# EAGLE design HDMI-Display_v11 (EAGLE 7.5.0)

## Sheet 1 of 2
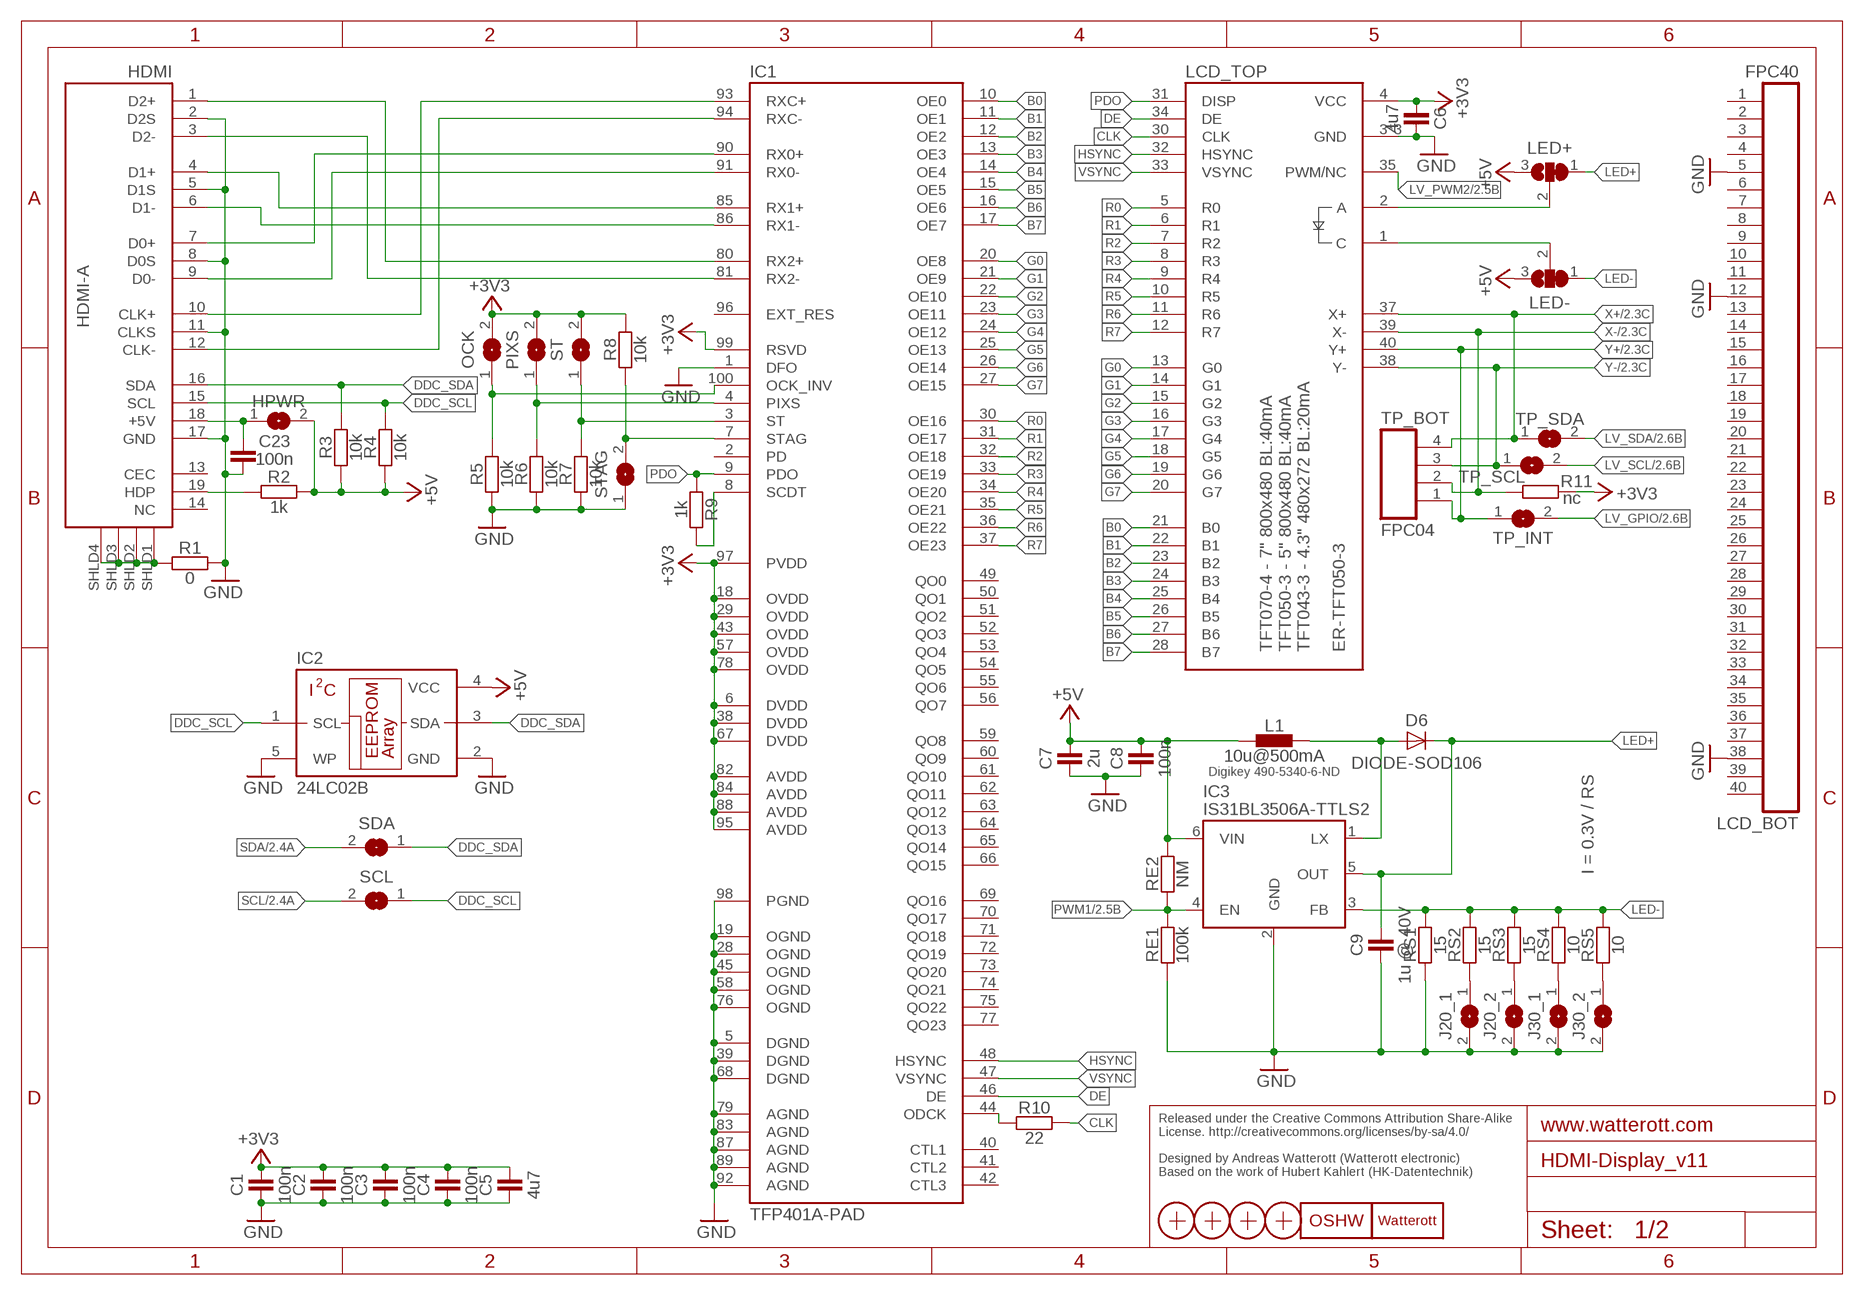
[diagram p0: schematic, sheet 1]

### Parts
C1  100n  CAPACITOR-0402  [C0402]
C2  100n  CAPACITOR-0402  [C0402]
C3  100n  CAPACITOR-0402  [C0402]
C4  100n  CAPACITOR-0402  [C0402]
C5  4u7  CAPACITOR-0402  [C0402]
C6  4u7  CAPACITOR-0402  [C0402]
C7  2u  CAPACITOR-0402  [C0402]
C8  100n  CAPACITOR-0402  [C0402]
C9  1u @ 40V  CAPACITOR-0805  [C0805]
C23  100n  CAPACITOR-0402  [C0402]
D6  DIODE-SOD106  [SOD106]
HDMI  HDMI-A  [HDMI_10029449]
HPWR  JUMPER2-0402  [JUMPER2-0402]
IC1  TFP401A-PAD  [TQFP100-PAD]
IC2  24LC02B  24LC-I/OT  [SOT23-5]
IC3  IS31BL3506A-TTLS2  [SOT23-6]
J20_1  JUMPER2-0402  [JUMPER2-0402]
J20_2  JUMPER2-0402  [JUMPER2-0402]
J30_1  JUMPER2-0402  [JUMPER2-0402]
J30_2  JUMPER2-0402  [JUMPER2-0402]
L1  10u@500mA  INDUCTOR-1212  [L_1212]
LCD_BOT  FPC40  [FPC40]
LCD_TOP  ER-TFT050-3  [FPC40]
LED+  JUMPER3-0402  [JUMPER3-0402]
LED-  JUMPER3-0402  [JUMPER3-0402]
LOGO1  OSHW_LOGOX0070  [OSHW_6X70]
LOGO3  LOGO-S_PLACE_S  [SPARK_TPLACE_S]
OCK  JUMPER2-0201-NC  [JUMPER2-0201_NC]
PIXS  JUMPER2-0201-NC  [JUMPER2-0201_NC]
R1  0  RESISTOR-0402  [C0402]
R2  1k  RESISTOR-0402  [C0402]
R3  10k  RESISTOR-0402  [C0402]
R4  10k  RESISTOR-0402  [C0402]
R5  10k  RESISTOR-0402  [C0402]
R6  10k  RESISTOR-0402  [C0402]
R7  10k  RESISTOR-0402  [C0402]
R8  10k  RESISTOR-0402  [C0402]
R9  1k  RESISTOR-0402  [C0402]
R10  22  RESISTOR-0402  [C0402]
R11  nc  RESISTOR-0402  [C0402]
RE1  100k  RESISTOR-0402  [C0402]
RE2  NM  RESISTOR-0402  [C0402]
RS1  15  RESISTOR-0402  [C0402]
RS2  15  RESISTOR-0402  [C0402]
RS3  15  RESISTOR-0402  [C0402]
RS4  10  RESISTOR-0402  [C0402]
RS5  10  RESISTOR-0402  [C0402]
SCL  JUMPER2-0402  [JUMPER2-0402]
SDA  JUMPER2-0402  [JUMPER2-0402]
ST  JUMPER2-0201-NC  [JUMPER2-0201_NC]
STAG  JUMPER2-0201-NC  [JUMPER2-0201_NC]
TP_BOT  FPC04  [FPC04]
TP_INT  JUMPER2-0402  [JUMPER2-0402]
TP_SCL  JUMPER2-0402  [JUMPER2-0402]
TP_SDA  JUMPER2-0402  [JUMPER2-0402]
X1  PASSER-07  [PASSER_07MM]
X2  PASSER-07  [PASSER_07MM]
X3  PASSER-07  [PASSER_07MM]
X4  PASSER-07  [PASSER_07MM]

### Nets
+3V3: C1.2 C2.2 C3.2 C4.2 C5.2 C6.1 IC1.6(DVDD) IC1.18(OVDD) IC1.29(OVDD) IC1.38(DVDD) IC1.43(OVDD) IC1.57(OVDD) IC1.67(DVDD) IC1.78(OVDD) IC1.82(AVDD) IC1.84(AVDD) IC1.88(AVDD) IC1.95(AVDD) IC1.97(PVDD) IC1.99(RSVD) LCD_TOP.4(VCC) OCK.2 PIXS.2 R8.2 R11.2 ST.2 ; also sheet 2
+5V: C7.2 C8.2 HPWR.2 IC2.4(VCC) IC3.6(VIN) L1.1 LED+.3 LED-.3 R2.2 R3.1 R4.1 RE2.2 ; also sheet 2
B0: IC1.10(OE0) LCD_TOP.21(B0)
B1: IC1.11(OE1) LCD_TOP.22(B1)
B2: IC1.12(OE2) LCD_TOP.23(B2)
B3: IC1.13(OE3) LCD_TOP.24(B3)
B4: IC1.14(OE4) LCD_TOP.25(B4)
B5: IC1.15(OE5) LCD_TOP.26(B5)
B6: IC1.16(OE6) LCD_TOP.27(B6)
B7: IC1.17(OE7) LCD_TOP.28(B7)
CLK: LCD_TOP.30(CLK) R10.2
CLK_N: HDMI.12(CLK-) IC1.94(RXC-)
CLK_P: HDMI.10(CLK+) IC1.93(RXC+)
D0_N: HDMI.9(D0-) IC1.91(RX0-)
D0_P: HDMI.7(D0+) IC1.90(RX0+)
D1_N: HDMI.6(D1-) IC1.86(RX1-)
D1_P: HDMI.4(D1+) IC1.85(RX1+)
D2_N: HDMI.3(D2-) IC1.81(RX2-)
D2_P: HDMI.1(D2+) IC1.80(RX2+)
DDC_SCL: HDMI.15(SCL) IC2.1(SCL) R4.2 SCL.1
DDC_SDA: HDMI.16(SDA) IC2.3(SDA) R3.2 SDA.1
DE: IC1.46(DE) LCD_TOP.34(DE)
G0: IC1.20(OE8) LCD_TOP.13(G0)
G1: IC1.21(OE9) LCD_TOP.14(G1)
G2: IC1.22(OE10) LCD_TOP.15(G2)
G3: IC1.23(OE11) LCD_TOP.16(G3)
G4: IC1.24(OE12) LCD_TOP.17(G4)
G5: IC1.25(OE13) LCD_TOP.18(G5)
G6: IC1.26(OE14) LCD_TOP.19(G6)
G7: IC1.27(OE15) LCD_TOP.20(G7)
GND: C1.1 C2.1 C3.1 C4.1 C5.1 C6.2 C7.1 C8.1 C9.1 C23.1 HDMI.2(D2S) HDMI.5(D1S) HDMI.8(D0S) HDMI.11(CLKS) HDMI.17(GND) IC1.1(DFO) IC1.5(DGND) IC1.19(OGND) IC1.28(OGND) IC1.39(DGND) IC1.45(OGND) IC1.58(OGND) IC1.68(DGND) IC1.76(OGND) IC1.79(AGND) IC1.83(AGND) IC1.87(AGND) IC1.89(AGND) IC1.92(AGND) IC1.98(PGND) IC2.2(GND) IC2.5(WP) IC3.2(GND) J20_1.2 J20_2.2 J30_1.2 J30_2.2 LCD_BOT.5 LCD_BOT.12 LCD_BOT.38 LCD_TOP.3(GND) LCD_TOP.29(GND) LCD_TOP.36(GND) R1.1 R5.1 R6.1 R7.1 RE1.1 RS1.1 STAG.1 ; also sheet 2
HDMI_5V: C23.2 HDMI.18(+5V) HPWR.1
HDMI_DECT: HDMI.19(HDP) R2.1
HSYNC: IC1.48(HSYNC) LCD_TOP.32(HSYNC)
LED+: C9.2 D6.C IC3.5(OUT) LED+.1
LED-: IC3.3(FB) LED-.1 RS1.2 RS2.2 RS3.2 RS4.2 RS5.2
LEDA: LCD_TOP.2(A) LED+.2
LEDC: LCD_TOP.1(C) LED-.2
LV_GPIO: TP_INT.2 ; also sheet 2
LV_PWM2: LCD_TOP.35(PWM/NC) ; also sheet 2
LV_SCL: TP_SCL.2 ; also sheet 2
LV_SDA: TP_SDA.2 ; also sheet 2
LX: D6.A IC3.1(LX) L1.2
N$1: J20_2.1 RS3.1
N$3: IC1.44(ODCK) R10.1
N$4: J30_1.1 RS4.1
N$5: J20_1.1 RS2.1
N$7: J30_2.1 RS5.1
OCKINV: IC1.100(OCK_INV) OCK.1 R5.2
PDO: IC1.9(PDO) LCD_TOP.31(DISP) R9.1
PIXS: IC1.4(PIXS) PIXS.1 R6.2
PWM1: IC3.4(EN) RE1.2 RE2.1 ; also sheet 2
R0: IC1.30(OE16) LCD_TOP.5(R0)
R1: IC1.31(OE17) LCD_TOP.6(R1)
R2: IC1.32(OE18) LCD_TOP.7(R2)
R3: IC1.33(OE19) LCD_TOP.8(R3)
R4: IC1.34(OE20) LCD_TOP.9(R4)
R5: IC1.35(OE21) LCD_TOP.10(R5)
R6: IC1.36(OE22) LCD_TOP.11(R6)
R7: IC1.37(OE23) LCD_TOP.12(R7)
SCDT: IC1.8(SCDT) R9.2
SCL: SCL.2 ; also sheet 2
SDA: SDA.2 ; also sheet 2
SHLD3: HDMI.SHLD1(SHLD) HDMI.SHLD2(SHLD) HDMI.SHLD3(SHLD) HDMI.SHLD4(SHLD) R1.2
ST: IC1.3(ST) R7.2 ST.1
STAG: IC1.7(STAG) R8.1 STAG.2
VSYNC: IC1.47(VSYNC) LCD_TOP.33(VSYNC)
X+: LCD_TOP.37(X+) TP_BOT.4 TP_SDA.1 ; also sheet 2
X-: LCD_TOP.39(X-) R11.1 TP_BOT.2 ; also sheet 2
Y+: LCD_TOP.40(Y+) TP_BOT.1 TP_INT.1 ; also sheet 2
Y-: LCD_TOP.38(Y-) TP_BOT.3 TP_SCL.1 ; also sheet 2
Unconnected: HDMI.13(CEC) HDMI.14(NC) IC1.2(PD) IC1.40(CTL1) IC1.41(CTL2) IC1.42(CTL3) IC1.49(QO0) IC1.50(QO1) IC1.51(QO2) IC1.52(QO3) IC1.53(QO4) IC1.54(QO5) IC1.55(QO6) IC1.56(QO7) IC1.59(QO8) IC1.60(QO9) IC1.61(QO10) IC1.62(QO11) IC1.63(QO12) IC1.64(QO13) IC1.65(QO14) IC1.66(QO15) IC1.69(QO16) IC1.70(QO17) IC1.71(QO18) IC1.72(QO19) IC1.73(QO20) IC1.74(QO21) IC1.75(QO22) IC1.77(QO23) IC1.96(EXT_RES) LCD_BOT.1 LCD_BOT.2 LCD_BOT.3 LCD_BOT.4 LCD_BOT.6 LCD_BOT.7 LCD_BOT.8 LCD_BOT.9 LCD_BOT.10 LCD_BOT.11 LCD_BOT.13 LCD_BOT.14 LCD_BOT.15 LCD_BOT.16 LCD_BOT.17 LCD_BOT.18 LCD_BOT.19 LCD_BOT.20 LCD_BOT.21 LCD_BOT.22 LCD_BOT.23 LCD_BOT.24 LCD_BOT.25 LCD_BOT.26 LCD_BOT.27 LCD_BOT.28 LCD_BOT.29 LCD_BOT.30 LCD_BOT.31 LCD_BOT.32 LCD_BOT.33 LCD_BOT.34 LCD_BOT.35 LCD_BOT.36 LCD_BOT.37 LCD_BOT.39 LCD_BOT.40

### Notes on the sheet
- TFT070-4 - 7" 800x480 BL:40mA
  TFT050-3 - 5" 800x480 BL:40mA
  TFT043-3 - 4.3" 480x272 BL:20mA
- Digikey 490-5340-6-ND
- I = 0.3V / RS
- Released under the Creative Commons Attribution Share-Alike 
  License. http://creativecommons.org/licenses/by-sa/4.0/
  
  Designed by Andreas Watterott (Watterott electronic)
  Based on the work of Hubert Kahlert (HK-Datentechnik)

## Sheet 2 of 2
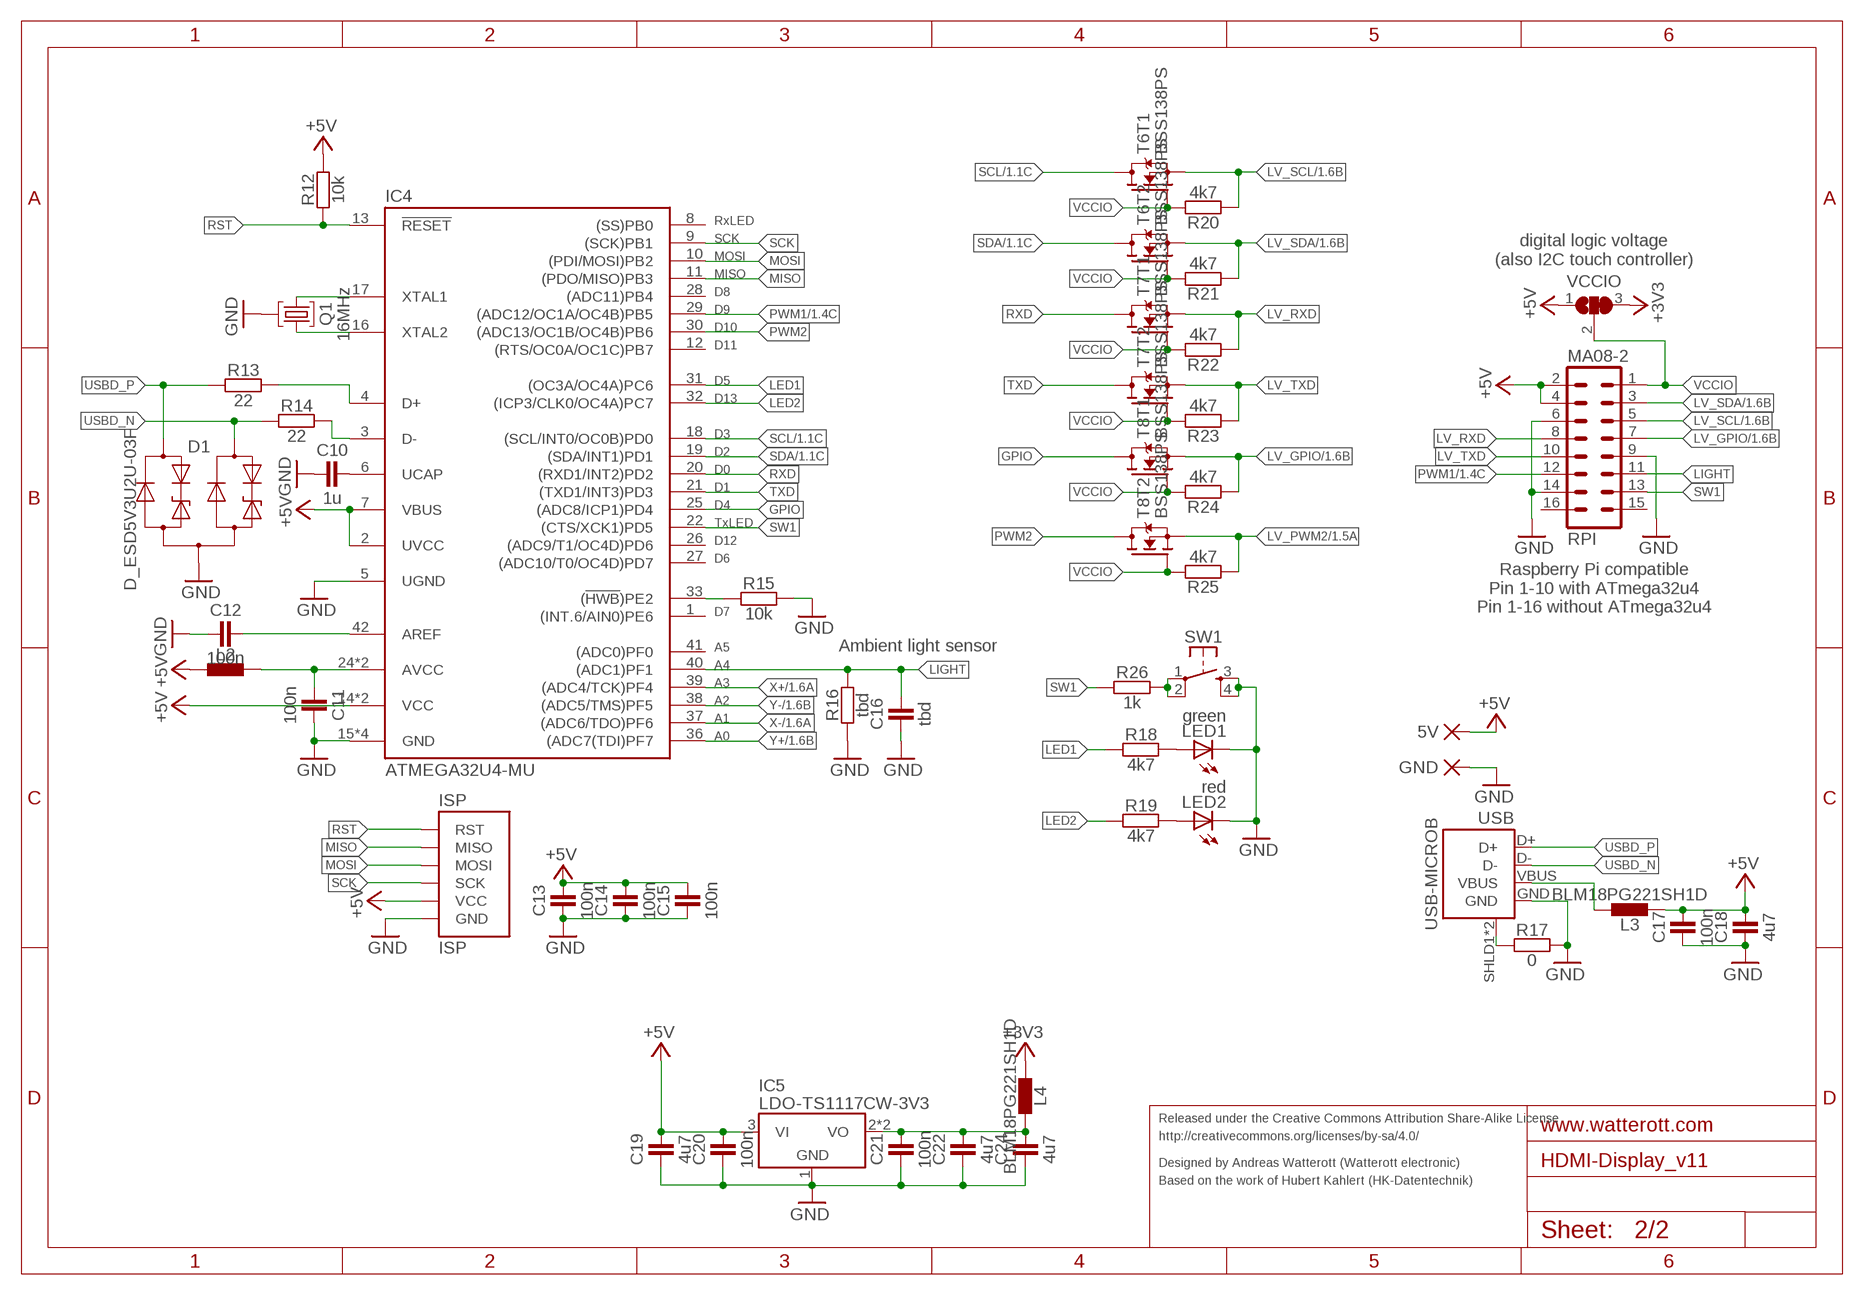
[diagram p1: schematic, sheet 2]

### Parts
5V  PAD-1.27X2.54_NC  [PAD-1.27X2.54_NC]
C10  1u  CAPACITOR-0402  [C0402]
C11  100n  CAPACITOR-0402  [C0402]
C12  100n  CAPACITOR-0402  [C0402]
C13  100n  CAPACITOR-0402  [C0402]
C14  100n  CAPACITOR-0402  [C0402]
C15  100n  CAPACITOR-0402  [C0402]
C16  tbd  CAPACITOR-0402  [C0402]
C17  100n  CAPACITOR-0402  [C0402]
C18  4u7  CAPACITOR-0402  [C0402]
C19  4u7  CAPACITOR-0402  [C0402]
C20  100n  CAPACITOR-0402  [C0402]
C21  100n  CAPACITOR-0402  [C0402]
C22  4u7  CAPACITOR-0402  [C0402]
C24  4u7  CAPACITOR-0402  [C0402]
D1  D_ESD5V3U2U-03F  [SOT723]
GND  PAD-1.27X2.54_NC  [PAD-1.27X2.54_NC]
IC4  ATMEGA32U4-MU  [QFN44]
IC5  LDO-TS1117CW-3V3  [SOT223]
ISP  ISP  [ISP-2X3]
L2  INDUCTOR-0603  [C0603]
L3  BLM18PG221SH1D  INDUCTOR-0603  [C0603]
L4  BLM18PG221SH1D  INDUCTOR-0603  [C0603]
LED1  green  LED-0603  [C0603]
LED2  red  LED-0603  [C0603]
Q1  16MHz  CRYSTAL-RES-32  [CRYSTAL_32X13]
R12  10k  RESISTOR-0402  [C0402]
R13  22  RESISTOR-0402  [C0402]
R14  22  RESISTOR-0402  [C0402]
R15  10k  RESISTOR-0402  [C0402]
R16  tbd  RESISTOR-0402  [C0402]
R17  0  RESISTOR-0402  [C0402]
R18  4k7  RESISTOR-0402  [C0402]
R19  4k7  RESISTOR-0402  [C0402]
R20  4k7  RESISTOR-0402  [C0402]
R21  4k7  RESISTOR-0402  [C0402]
R22  4k7  RESISTOR-0402  [C0402]
R23  4k7  RESISTOR-0402  [C0402]
R24  4k7  RESISTOR-0402  [C0402]
R25  4k7  RESISTOR-0402  [C0402]
R26  1k  RESISTOR-0402  [C0402]
RPI  MA08-2  [MA08-2]
SW1  SW-TACTILE-PTS840P  [PTS840P]
T6  BSS138PS  [SOT363]
T7  BSS138PS  [SOT363]
T8  BSS138PS  [SOT363]
USB  USB-MICROB  [USB-MICROB-10103594]
VCCIO  JUMPER3-0402  [JUMPER3-0402]

### Nets
3VOUT: C21.2 C22.2 C24.2 IC5.2(VO) IC5.4(VO) L4.2
+3V3: L4.1 VCCIO.3 ; also sheet 1
+5V: 5V.1(P) C13.2 C14.2 C15.2 C17.2 C18.2 C19.2 C20.2 IC4.2(UVCC) IC4.7(VBUS) IC4.14(VCC) IC4.34(VCC) IC5.3(VI) ISP.VCC L2.1 L3.1 R12.2 RPI.2 RPI.4 VCCIO.1 ; also sheet 1
AREF: C12.2 IC4.42(AREF)
AVCC: C11.1 IC4.24(AVCC) IC4.44(AVCC) L2.2
D_N: IC4.3(D-) R14.2
D_P: IC4.4(D+) R13.2
GND: C10.1 C11.2 C12.1 C13.1 C14.1 C15.1 C16.1 C17.1 C18.1 C19.1 C20.1 C21.1 C22.1 C24.1 D1.3(A) GND.1(P) IC4.5(UGND) IC4.15(GND) IC4.23(GND) IC4.35(GND) IC4.43(GND) IC5.1(GND) ISP.GND LED1.C LED2.C Q1.GND R15.2 R16.1 R17.1 RPI.6 RPI.9 RPI.14 SW1.3(S1) SW1.4(S2) USB.GND ; also sheet 1
GPIO: IC4.25((ADC8/ICP1)PD4) T8.6(T1:D)
HWB: IC4.33((!HWB!)PE2) R15.1
LED1: IC4.31((OC3A/OC4A)PC6) R18.1
LED2: IC4.32((ICP3/CLK0/OC4A)PC7) R19.1
LIGHT: C16.2 IC4.40((ADC1)PF1) R16.2 RPI.11
LV_GPIO: R24.1 RPI.7 T8.1(T1:S) ; also sheet 1
LV_PWM2: R25.1 T8.4(T2:S) ; also sheet 1
LV_RXD: R22.1 RPI.8 T7.1(T1:S)
LV_SCL: R20.1 RPI.5 T6.1(T1:S) ; also sheet 1
LV_SDA: R21.1 RPI.3 T6.4(T2:S) ; also sheet 1
LV_TXD: R23.1 RPI.10 T7.4(T2:S)
MISO: IC4.11((PDO/MISO)PB3) ISP.MISO
MOSI: IC4.10((PDI/MOSI)PB2) ISP.MOSI
N$6: R26.2 SW1.1 SW1.2
N$17: LED1.A R18.2
N$18: LED2.A R19.2
PWM1: IC4.29((ADC12/OC1A/OC4B)PB5) RPI.12 ; also sheet 1
PWM2: IC4.30((ADC13/OC1B/OC4B)PB6) T8.3(T2:D)
RST: IC4.13(!RESET) ISP.RST R12.1
RXD: IC4.20((RXD1/INT2)PD2) T7.6(T1:D)
SCK: IC4.9((SCK)PB1) ISP.SCK
SCL: IC4.18((SCL/INT0/OC0B)PD0) T6.6(T1:D) ; also sheet 1
SDA: IC4.19((SDA/INT1)PD1) T6.3(T2:D) ; also sheet 1
SHLD1: R17.2 USB.SHLD1(SHIELD) USB.SHLD2(SHIELD)
SW1: IC4.22((CTS/XCK1)PD5) R26.1 RPI.13
TXD: IC4.21((TXD1/INT3)PD3) T7.3(T2:D)
UCAP: C10.2 IC4.6(UCAP)
USBD_N: D1.2(C2) R14.1 USB.D-
USBD_P: D1.1(C1) R13.1 USB.D+
VBUS: L3.2 USB.VBUS
VCCIO: R20.2 R21.2 R22.2 R23.2 R24.2 R25.2 RPI.1 T6.2(T1:G) T6.5(T2:G) T7.2(T1:G) T7.5(T2:G) T8.2(T1:G) T8.5(T2:G) VCCIO.2
X+: IC4.39((ADC4/TCK)PF4) ; also sheet 1
X-: IC4.37((ADC6/TDO)PF6) ; also sheet 1
XTAL1: IC4.17(XTAL1) Q1.2
XTAL2: IC4.16(XTAL2) Q1.1
Y+: IC4.36((ADC7(TDI)PF7) ; also sheet 1
Y-: IC4.38((ADC5/TMS)PF5) ; also sheet 1
Unconnected: IC4.1((INT.6/AIN0)PE6) IC4.8((SS)PB0) IC4.12((RTS/OC0A/OC1C)PB7) IC4.26((ADC9/T1/OC4D)PD6) IC4.27((ADC10/T0/OC4D)PD7) IC4.28((ADC11)PB4) IC4.41((ADC0)PF0) RPI.15 RPI.16

### Notes on the sheet
- RxLED
- digital logic voltage
  (also I2C touch controller)
- SCK
- MOSI
- MISO
- D8
- D9
- D10
- D11
- D5
- D13
- D3
- D2
- D0
- D1
- D4
- TxLED
- D12
- D6
- Raspberry Pi compatible
  Pin 1-10 with ATmega32u4
  Pin 1-16 without ATmega32u4
- D7
- A5 | Ambient light sensor
- A4
- A3
- A2
- A1
- A0
- Released under the Creative Commons Attribution Share-Alike License
- http://creativecommons.org/licenses/by-sa/4.0/
- Designed by Andreas Watterott (Watterott electronic)
- Based on the work of Hubert Kahlert (HK-Datentechnik)

## Library data of the parts
5V GND = we-rcl:PAD: Pads
C1-C24 = we-rcl:CAPACITOR: Capacitors ...4.7uF @ 6.3V -> 0402 ...10uF @ 16V -> 0603 ...22uF @ 25V -> 0805
D1 = we-rcl:D_ESD5V3U2U: TVS Diode - Uni-directional Ultra Low ESD / Transient Protection Diode (0.4pF@1MHz, 5V); DIGIKEY: ESD5V3U2U-03F H6327DKR-ND
D6 = we-rcl:DIODE: Diodes
HDMI = we-con:HDMI: HDMI Connectors; DIGIKEY: 609-4614-2-ND
HPWR J20_1 J20_2 J30_1 J30_2 OCK PIXS SCL SDA ST STAG TP_INT TP_SCL TP_SDA = we-rcl:JUMPER2: 2 Pin Jumpers
IC1 = we-chip:TFP401A: TI TFP401A HDMI/DVI Receiver; DIGIKEY: 296-9987-ND
IC2 = we-chip:24LC*: Microchip I2C EEPROM 2 Kbit - 24LC02B - 24LC02BT-I/OTDKR-ND 32 Kbit- 24LC32A - 24LC32AT-I/OTDKR-ND; DIGIKEY: 24LC32AT-I/OTDKR-ND
IC3 = we-power:IS31BL3506A: ISSI IS31BL3506A Boost Converter for LED Backlight Input: 2.7...5V Output: up to 35V 300mV Feedback Voltage; DIGIKEY: 706-1213-6-ND
IC4 = we-chip:ATMEGA32U4: Atmel ATmega16U4/32U4 AVR Microcontroller
IC5 = we-power:LDO: LDOs TS1117 800mA max 16V - compatible AP1117 1A max 18V, NCP1117 1A max 20V TS9011 250mA max 12V - compatible AP2210 300mA max 15V TS5204 150mA max 16V
ISP = we-board:ISP: AVR ISP 6pol connector
L1 = we-power:INDUCTOR: Power Inductors Taiyo Yuden NR6028 NR6028T1R5N - 1.5uH, 16mOhm, Ir=5.00A NR6028T2R2N - 2.2uH, 20mOhm, Ir=4.20A NR6028T3R0N - 3.0uH, 23mOhm, Ir=3.60A NR6028T4R7M - 4.7uH, 31mOhm, Ir=2.70A NR6028T6R0M - 6.0uH, 40mOhm, Ir=2.50A NR6028T100M - 10uH, 65mOhm, Ir=1.90A NR6028T150M - 15uH, 95mOhm, Ir=1.60A NR6028T220M - 22uH, 135mOhm, Ir=1.30A NR6028T330M - 33uH, 220mOhm, Ir=1.10A NR6028T470M - 47uH, 300mOhm, Ir=0.95A NR6028T680M - 68uH, 420mOhm, Ir=0.76A NR6028T101M - 100uH, 600mOhm, Ir=0.62A
L2-L4 = we-rcl:INDUCTOR: Inductors Ferrite Bead 0603 1.4A 220Ohm @ 100MH, -> Murata BLM18PG221SH1D 0603 1.0A 20Ohm @ 100MH -> Murata BLM18PG300SN1D
LCD_BOT = we-con:FPC40: FPC/ZIF Connector FCI 62684-402100AHLF -> 40 Pins 0.5mm top contact FCI 62684-401100AHLF -> 40 Pins 0.5mm bottom contact; DIGIKEY_BOT: 62684-401100AHLF-ND; DIGIKEY_TOP: 62684-402100AHLF-ND
LCD_TOP = we-opto:ER-TFT: ER TFT Displays TFT043-3 - 4.3" 480x272 (LED 15mA @ 25.0V) TFT050-3 - 5.0" 800x480 (LED @ 40mA @ 19.2V) TFT070-4 - 7.0" 800x480 (LED @ 40mA @ 20.4V)
LED1 LED2 = we-opto:LED: LEDs red, green, blue -> 0603
LED+ LED- VCCIO = we-rcl:JUMPER3: 3 Pin Jumpers
LOGO1 = we-symbol:OSHW_LOGO: Open-Source-Hardware Logo
LOGO3 = we-symbol:LOGO: Watterott electronic Logo
Q1 = we-rcl:CRYSTAL-RES: Crystal Resonators 8MHz and 16MHz -> 32x13
R1-R26 RE1 RE2 RS1-RS5 = we-rcl:RESISTOR: Resistors all kinds in 0603 and 0402
RPI = we-con:MA08-2: Pin Header
SW1 = we-switch:SW-TACTILE: Tactile Switches; DIGIKEY: CKN10511DKR-ND
T6-T8 = we-transistor:BSS138PS: BSS138 Dual N-Channel MOSFET (UGS +/-20V, RDS 1Ohm, ID 320mA)
TP_BOT = we-con:FPC04: FPC/ZIF Connector FCI HFW4R-1STE1LF -> 4 Pin 1mm bottom contact FCI HFW4R-2STE1LF -> 4 Pin 1mm top contact; DIGIKEY_BOT: 609-1782-6-ND; DIGIKEY_TOP: 609-1783-6-ND
USB = we-con:USB: USB Connectors; DIGIKEY: 609-4050-6-ND
X1-X4 = we-symbol:PASSER: Fiducial Markers

## Board
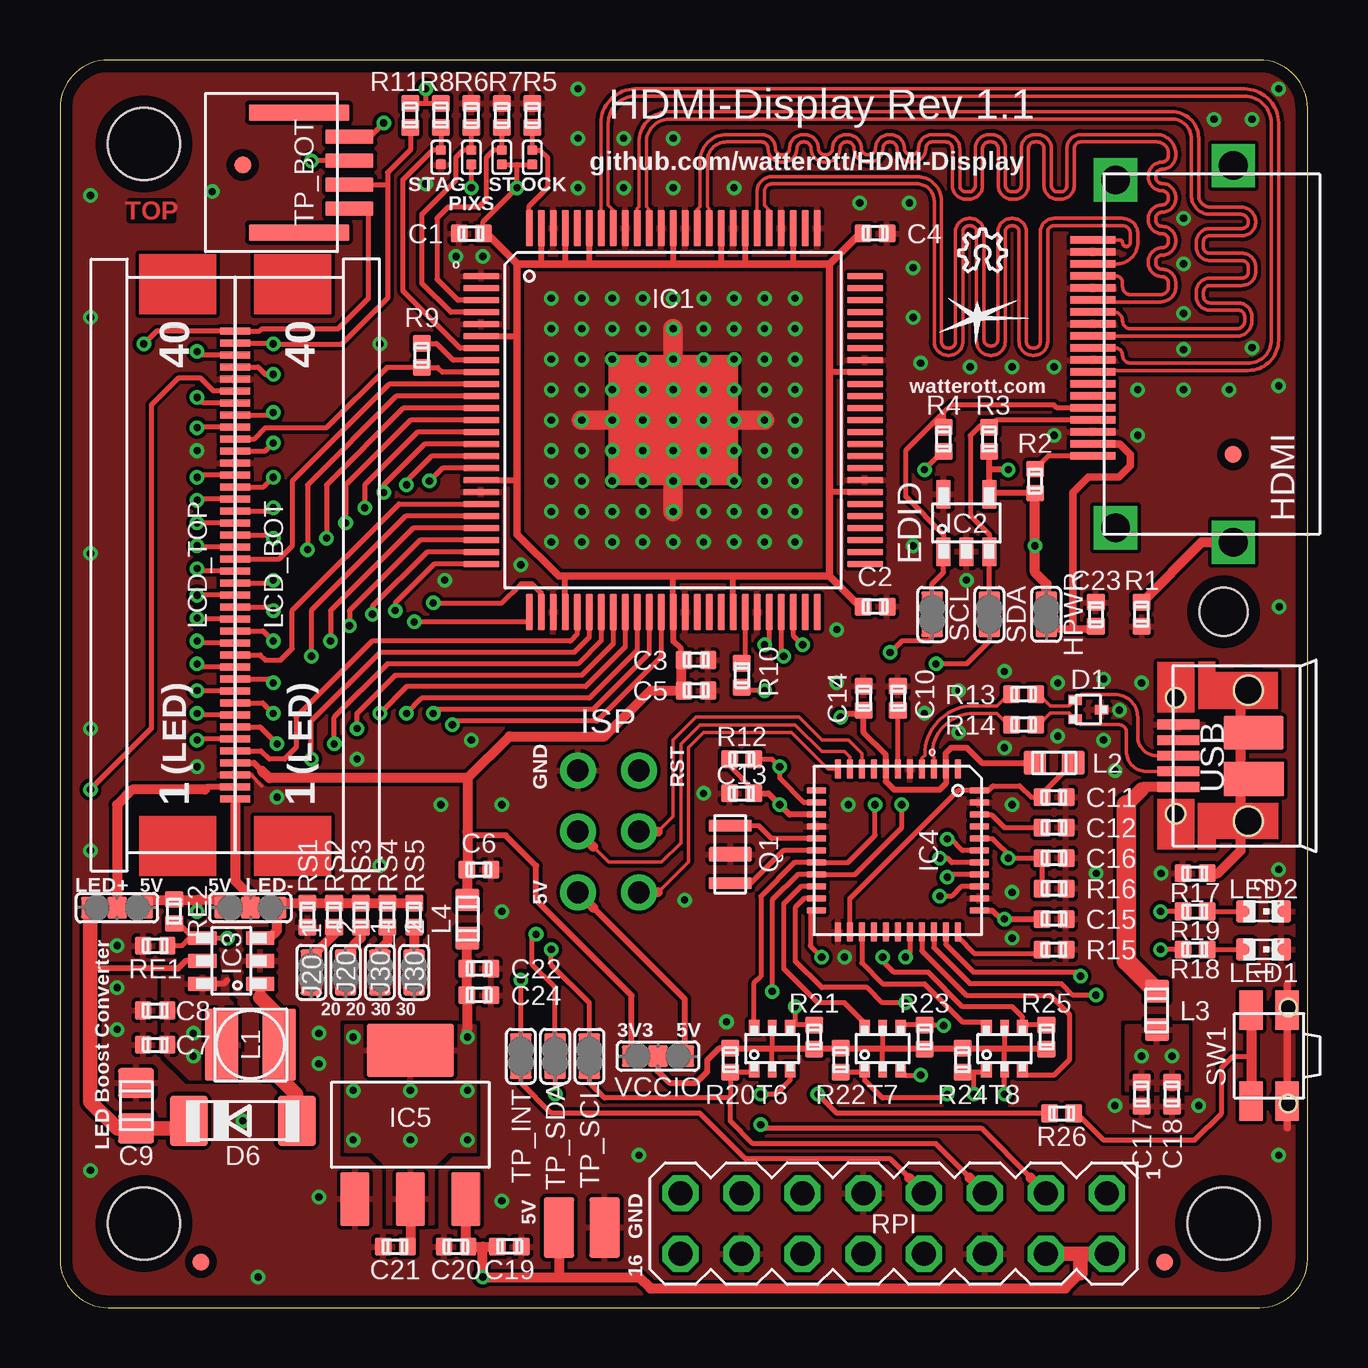
[diagram p2: board, top side]
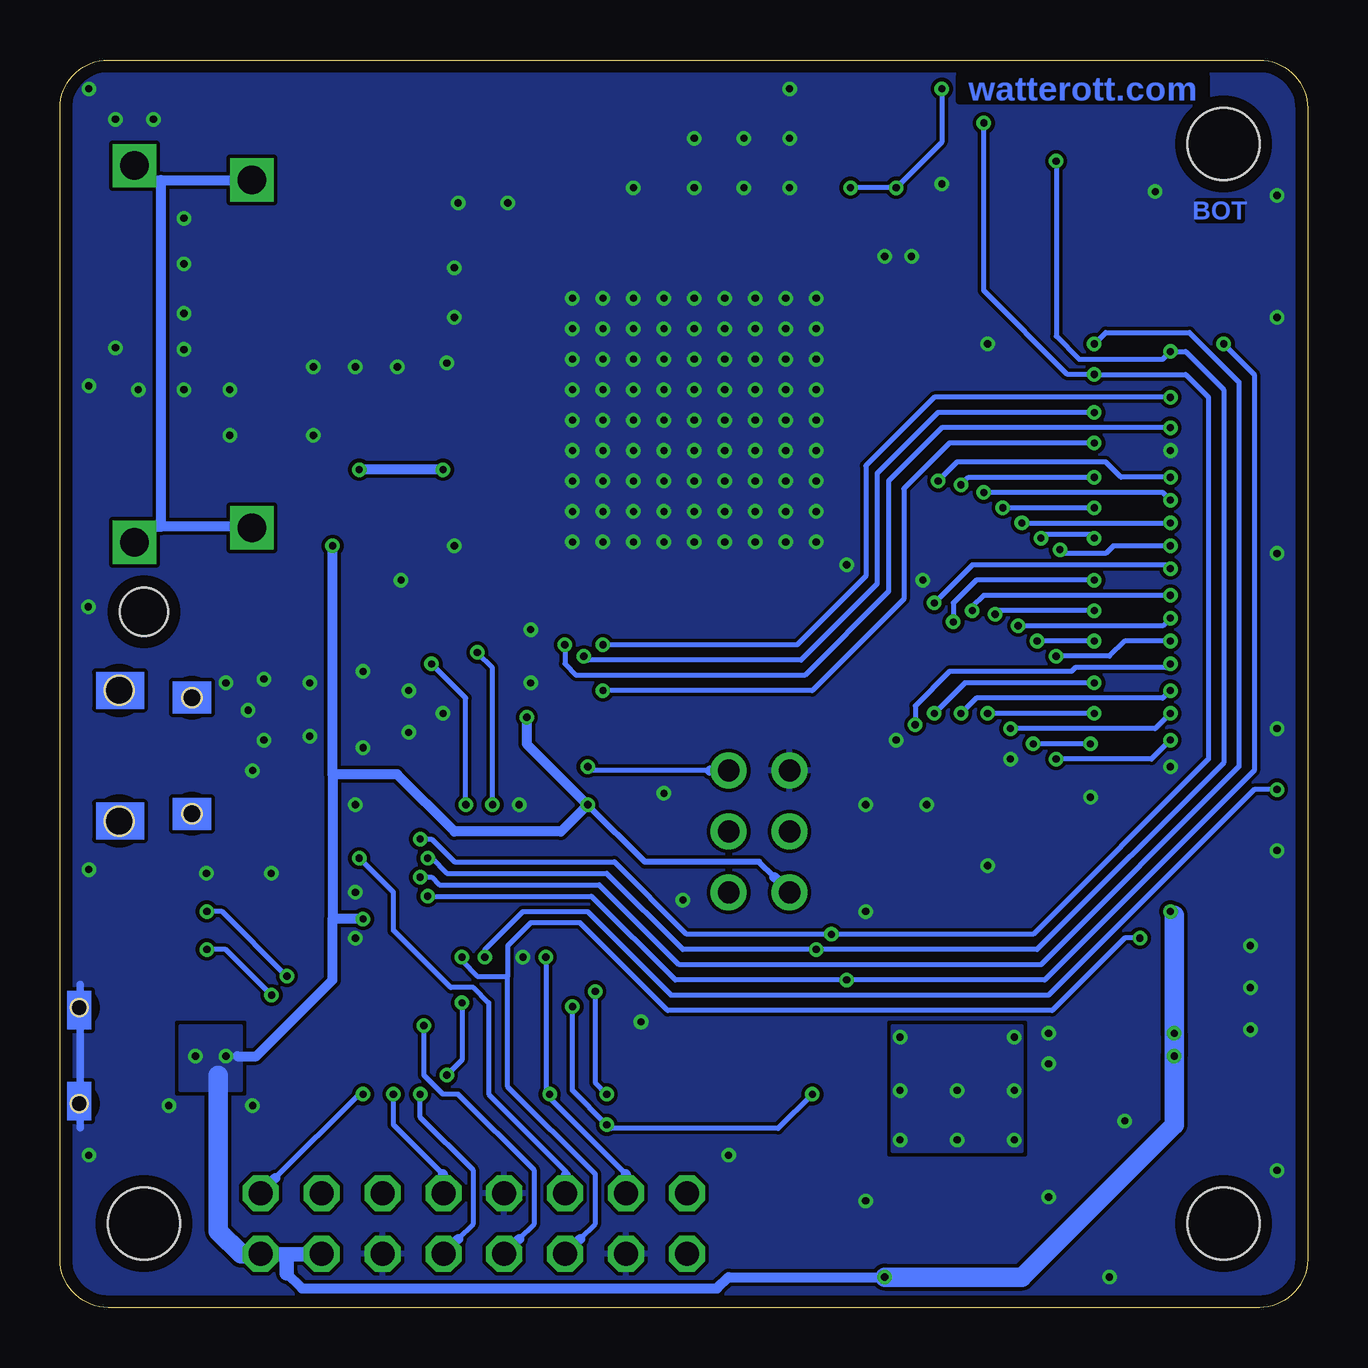
[diagram p3: board, bottom side, seen from below]

Size 52 x 52 mm. Coordinates in mm from the lower left corner, seen from the top.
Outline: 2,0 50,0 arc90 52,2 52,50 arc90 50,52 2,52 arc90 0,50 0,2 arc90 2,0
Copper layers (1*16): Top 0.035mm / dielectric 1.5mm / Bottom 0.035mm
Design rules "default *": minimum track width 6mil, minimum drill 0.3mm, track to track 6mil, track to pad 6mil, pad to pad 6mil, via to via 6mil, smd to smd 6mil, copper to edge 20mil, drill to drill 6mil, minimum pad ring 8mil, minimum via ring 6mil, stop-mask expansion 4mil, vias tented up to drill 0.5mm, thermal gap 6mil
Holes 3 mm at 48.5,3.5 3.5,3.5 3.5,48.5
Holes 2 mm at 48.5,29

### Footprints (pad centres in the part's own frame; a part is rotated, then mirrored left to right if it is on the bottom)
PAD-1.27X2.54_NC = smd 1.27 x 2.54: 1 0,0
C0402 = smd 0.75 x 0.7: 1 0,0.5; 2 0,-0.5
C0805 = smd 1.5 x 1.25: 1 0,0.95; 2 0,-0.95
SOT723 = smd 0.6 x 0.4: 1 -0.55,0.4; 2 -0.55,-0.4; 3 0.55,0
SOD106 = smd 2.1 x 1.6: A 0,-2.25; C 0,2.25
HDMI_10029449 = smd 1.9 x 0.3: 1 -0.95,4.75; 2 -0.95,4.25; 3 -0.95,3.75; 4 -0.95,3.25; 5 -0.95,2.75; 6 -0.95,2.25; 7 -0.95,1.75; 8 -0.95,1.25; 9 -0.95,0.75; 10 -0.95,0.25; 11 -0.95,-0.25; 12 -0.95,-0.75; 13 -0.95,-1.25; 14 -0.95,-1.75; 15 -0.95,-2.25; 16 -0.95,-2.75; 17 -0.95,-3.25; 18 -0.95,-3.75; 19 -0.95,-4.25 | drill 1.2 pad 1.8 square: SHLD1 0,-7.25; SHLD2 4.9,-7.85; SHLD3 4.9,7.85; SHLD4 0,7.25
JUMPER2-0402 = smd 0.9 x 0.8: 1 0,0.55; 2 0,-0.55
TQFP100-PAD = smd 1.5 x 0.28: 1 -8,6; 2 -8,5.5; 3 -8,5; 4 -8,4.5; 5 -8,4; 6 -8,3.5; 7 -8,3; 8 -8,2.5; 9 -8,2; 10 -8,1.5; 11 -8,1; 12 -8,0.5; 13 -8,0; 14 -8,-0.5; 15 -8,-1; 16 -8,-1.5; 17 -8,-2; 18 -8,-2.5; 19 -8,-3; 20 -8,-3.5; 21 -8,-4; 22 -8,-4.5; 23 -8,-5; 24 -8,-5.5; 25 -8,-6; 51 8,-6; 52 8,-5.5; 53 8,-5; 54 8,-4.5; 55 8,-4; 56 8,-3.5; 57 8,-3; 58 8,-2.5; 59 8,-2; 60 8,-1.5; 61 8,-1; 62 8,-0.5; 63 8,0; 64 8,0.5; 65 8,1; 66 8,1.5; 67 8,2; 68 8,2.5; 69 8,3; 70 8,3.5; 71 8,4; 72 8,4.5; 73 8,5; 74 8,5.5; 75 8,6 | smd 0.28 x 1.5: 26 -6,-8; 27 -5.5,-8; 28 -5,-8; 29 -4.5,-8; 30 -4,-8; 31 -3.5,-8; 32 -3,-8; 33 -2.5,-8; 34 -2,-8; 35 -1.5,-8; 36 -1,-8; 37 -0.5,-8; 38 0,-8; 39 0.5,-8; 40 1,-8; 41 1.5,-8; 42 2,-8; 43 2.5,-8; 44 3,-8; 45 3.5,-8; 46 4,-8; 47 4.5,-8; 48 5,-8; 49 5.5,-8; 50 6,-8; 76 6,8; 77 5.5,8; 78 5,8; 79 4.5,8; 80 4,8; 81 3.5,8; 82 3,8; 83 2.5,8; 84 2,8; 85 1.5,8; 86 1,8; 87 0.5,8; 88 0,8; 89 -0.5,8; 90 -1,8; 91 -1.5,8; 92 -2,8; 93 -2.5,8; 94 -3,8; 95 -3.5,8; 96 -4,8; 97 -4.5,8; 98 -5,8; 99 -5.5,8; 100 -6,8
SOT23-5 = smd 1.2 x 0.6: 1 -1.2,0.95; 2 -1.2,0; 3 -1.2,-0.95; 4 1.2,-0.95; 5 1.2,0.95
SOT23-6 = smd 1.2 x 0.6: 1 -1.2,0.95; 2 -1.2,0; 3 -1.2,-0.95; 4 1.2,-0.95; 5 1.2,0; 6 1.2,0.95
QFN44 = smd 0.8 x 0.28: 1 -3.4,2.5; 2 -3.4,2; 3 -3.4,1.5; 4 -3.4,1; 5 -3.4,0.5; 6 -3.4,0; 7 -3.4,-0.5; 8 -3.4,-1; 9 -3.4,-1.5; 10 -3.4,-2; 11 -3.4,-2.5; 23 3.4,-2.5; 24 3.4,-2; 25 3.4,-1.5; 26 3.4,-1; 27 3.4,-0.5; 28 3.4,0; 29 3.4,0.5; 30 3.4,1; 31 3.4,1.5; 32 3.4,2; 33 3.4,2.5 | smd 0.28 x 0.8: 12 -2.5,-3.4; 13 -2,-3.4; 14 -1.5,-3.4; 15 -1,-3.4; 16 -0.5,-3.4; 17 0,-3.4; 18 0.5,-3.4; 19 1,-3.4; 20 1.5,-3.4; 21 2,-3.4; 22 2.5,-3.4; 34 2.5,3.4; 35 2,3.4; 36 1.5,3.4; 37 1,3.4; 38 0.5,3.4; 39 0,3.4; 40 -0.5,3.4; 41 -1,3.4; 42 -1.5,3.4; 43 -2,3.4; 44 -2.5,3.4
SOT223 = smd 2.235 x 1.219: 1 -3.099,2.311; 2 -3.099,0; 3 -3.099,-2.311 | smd 2.2 x 3.6: 4 3.099,0
ISP-2X3 = drill 0.9 pad 1.5: GND 1.27,-2.54; MISO -1.27,2.54; MOSI 1.27,0; RST -1.27,-2.54; SCK -1.27,0; VCC 1.27,2.54
L_1212 = smd 3 x 1.4: 1 0,1.2; 2 0,-1.2
C0603 = smd 1 x 0.95: 1 0,0.8; 2 0,-0.8
FPC40 = smd 1.27 x 0.279: 1 0,9.75; 2 0,9.25; 3 0,8.75; 4 0,8.25; 5 0,7.75; 6 0,7.25; 7 0,6.75; 8 0,6.25; 9 0,5.75; 10 0,5.25; 11 0,4.75; 12 0,4.25; 13 0,3.75; 14 0,3.25; 15 0,2.75; 16 0,2.25; 17 0,1.75; 18 0,1.25; 19 0,0.75; 20 0,0.25; 21 0,-0.25; 22 0,-0.75; 23 0,-1.25; 24 0,-1.75; 25 0,-2.25; 26 0,-2.75; 27 0,-3.25; 28 0,-3.75; 29 0,-4.25; 30 0,-4.75; 31 0,-5.25; 32 0,-5.75; 33 0,-6.25; 34 0,-6.75; 35 0,-7.25; 36 0,-7.75; 37 0,-8.25; 38 0,-8.75; 39 0,-9.25; 40 0,-9.75
C0603' = smd 0.9 x 0.8: A 0,-0.75; C 0,0.75
JUMPER3-0402 = smd 0.9 x 0.8: 1 0,1.1; 2 0,0; 3 0,-1.1
JUMPER2-0201_NC = smd 0.4 x 0.4: 1 0,0.3; 2 0,-0.3
CRYSTAL_32X13 = smd 1.8 x 0.5: 1 0,1.2; 2 0,-1.2 | smd 1.8 x 0.6: GND 0,0
MA08-2 = drill 1 octagon: 1 -1.27,8.89; 2 1.27,8.89; 3 -1.27,6.35; 4 1.27,6.35; 5 -1.27,3.81; 6 1.27,3.81; 7 -1.27,1.27; 8 1.27,1.27; 9 -1.27,-1.27; 10 1.27,-1.27; 11 -1.27,-3.81; 12 1.27,-3.81; 13 -1.27,-6.35; 14 1.27,-6.35; 15 -1.27,-8.89; 16 1.27,-8.89
PTS840P = smd 1.65 x 1: 1 -1.9,0.75; 2 1.9,0.75; 3 -1.9,-0.75; 4 1.9,-0.75 | hole 0.7: -2,-0.8; 2,-0.8
SOT363 = smd 0.6 x 0.5: 1 -0.9,0.75; 3 -0.9,-0.75; 4 0.9,-0.75; 6 0.9,0.75 | smd 0.6 x 0.4: 2 -0.9,0; 5 0.9,0
FPC04 = smd 2 x 0.6: 1 0,1.5; 2 0,0.5; 3 0,-0.5; 4 0,-1.5 | smd 4.2 x 0.7: SHLD1 2.1,2.5; SHLD2 2.1,-2.5
USB-MICROB-10103594 = smd 1.8 x 0.4: D+ -2.885,0; D- -2.885,-0.65; GND -2.885,1.3; ID -2.885,0.65; VBUS -2.885,-1.3 | smd 2.5 x 1.425: SHLD1 0.25,-0.963; SHLD2 0.25,0.963 | hole 0.8: -3,2.425; -3,-2.425 | hole 1.2: 0.03,2.725; 0.03,-2.725
PASSER_07MM = smd 0.7 x 0.7: X 0,0

### Placement (x,y rotation side)
5V  20.8,3.33 0 top
C1  17.14,44.77 90 top
C2  33.97,29.21 270 top
C3  26.51,26.99 270 top
C4  33.97,44.77 270 top
C5  26.51,25.72 270 top
C6  17.46,18.26 90 top
C7  3.97,10.95 90 top
C8  3.97,12.38 90 top
C9  3.17,8.41 0 top
C10  34.92,25.4 0 top
C11  41.43,21.27 90 top
C12  41.43,20 270 top
C13  28.42,21.43 90 top
C14  33.5,25.4 0 top
C15  41.43,16.19 270 top
C16  41.43,18.73 270 top
C17  45.09,8.89 180 top
C18  46.35,8.89 180 top
C19  18.73,2.54 270 top
C20  16.51,2.54 90 top
C21  13.97,2.54 90 top
C22  17.46,14.13 270 top
C23  43.18,28.89 0 top
C24  17.46,13.02 270 top
D1  42.86,24.92 0 top
D6  7.62,7.78 90 top
GND  22.7,3.33 0 top
HDMI  44,39.75 0 top
HPWR  41.12,28.89 180 top
IC1  25.56,36.99 0 top
IC2  37.78,32.7 90 top
IC3  7.14,14.45 180 top
IC4  34.92,19.05 270 top
IC5  14.61,7.62 90 top
ISP  22.86,19.84 180 top
J20_1  10.48,13.97 0 top
J20_2  11.91,13.97 0 top
J30_1  13.34,13.97 0 top
J30_2  14.76,13.97 0 top
L1  7.94,10.95 90 top
L2  41.43,22.7 90 top
L3  45.72,12.38 180 top
L4  16.99,16.19 0 top
LCD_BOT  7.3,30.96 0 top
LCD_TOP  7.3,30.96 180 top
LED1  green  [C0603']  50.16,14.92 270 top
LED2  red  [C0603']  50.16,16.51 270 top
LED+  2.38,16.67 90 top
LED-  7.94,16.67 270 top
LOGO1  37.47,43.18 0 top
LOGO3  38.26,41.27 0 top
OCK  19.68,47.94 0 top
PIXS  17.14,47.94 0 top
Q1  27.94,18.89 0 top
R1  45.09,28.89 180 top
R2  40.64,34.45 0 top
R3  38.73,36.2 180 top
R4  36.83,36.2 180 top
R5  19.68,49.69 0 top
R6  17.14,49.69 0 top
R7  18.41,49.69 0 top
R8  15.88,49.69 180 top
R9  15.08,39.69 180 top
R10  28.42,26.35 0 top
R11  14.61,49.69 180 top
R12  28.42,22.86 270 top
R13  40.16,25.56 270 top
R14  40.16,24.29 270 top
R15  41.43,14.92 90 top
R16  41.43,17.46 270 top
R17  47.31,18.1 90 top
R18  47.31,14.92 90 top
R19  47.31,16.51 90 top
R20  27.94,10.32 180 top
R21  31.43,11.27 0 top
R22  32.54,10.32 180 top
R23  36.04,11.27 0 top
R24  37.62,10.32 180 top
R25  41.12,11.27 0 top
R26  41.75,8.1 90 top
RE1  3.97,15.08 90 top
RE2  4.76,16.51 180 top
RPI  34.75,3.5 270 top
RS1  10.32,16.35 180 top
RS2  11.43,16.35 180 top
RS3  12.54,16.35 180 top
RS4  13.65,16.35 180 top
RS5  14.76,16.35 180 top
SCL  36.35,28.89 0 top
SDA  38.73,28.89 0 top
ST  18.41,47.94 0 top
STAG  15.88,47.94 180 top
SW1  50.4,10.5 90 top
T6  29.69,10.79 90 top
T7  34.29,10.79 90 top
T8  39.37,10.79 90 top
TP_BOT  12.06,47.31 180 top
TP_INT  19.21,10.48 0 top
TP_SCL  22.07,10.48 0 top
TP_SDA  20.64,10.48 0 top
USB  49.5,23 0 top
VCCIO  24.92,10.48 270 top
X1  5.87,1.91 90 top
X2  7.62,47.62 90 top
X3  48.9,35.56 90 top
X4  46.04,1.91 90 top

### Tracks (layer width: path | path; a pad name or v marks a point on that pad's centre or on a via)
3VOUT  (via drill 0.3)
  Top 0.406: IC5.2 14.61,2.67 C21.2 | L4.2 16.96,15.37 C22.2 C24.2 16.96,11.56
  other vias: 12.22,11.27 12.22,6.99 16.99,6.99 16.99,11.27 16.99,9.05 12.22,9.05 14.61,6.99 14.61,9.05
  pour Bottom: 11.91,11.75 17.3,11.75 17.3,6.51 11.91,6.51
  pour Top: 11.91,11.75 17.3,11.75 17.3,6.51 16.19,6.51 15.56,5.87 15.56,3.49 13.65,3.49 13.65,5.87 13.02,6.51 11.91,6.51
+3V3  (via drill 0.3)
  Top 0.203: 20.06,43.55 20,43.5 | 22.06,43.51 22.07,43.5 | 30.56,43.58 30.48,43.5 | 28.56,43.51 28.57,43.5 | 27.56,43.56 27.62,43.5 | 32.13,38.99 32.07,39.05 | 32.08,33.99 32.07,33.97 | 28.06,30.44 28.1,30.48 | 21.06,30.43 21.11,30.48 | 19.04,40.49 19.05,40.48 | 19.03,39.99 19.05,40.01 | 19.01,34.49 19.05,34.45 | 21.06,43.55 21.11,43.5 | 25.88,27.46 25.88,26.99 C3.2 | ST.2 19.05,47.64 | 19.05,47.64 OCK.2 | R11.2 15.24,50.19 | 15.24,50.19 R8.2 | PIXS.2 v17.14,46.67 | 19.05,47.64 v19.05,46.67 17.64,45.27 C1.2 | v15.24,50.8 15.24,50.19 | 17.14,19.68 16.99,19.84 | C5.2 25.89,25.72 25.88,25.73
  Top 0.254: IC1.99 20.06,43.55 | IC1.95 22.06,43.51 | IC1.78 30.56,43.58 | IC1.82 28.56,43.51 | IC1.84 27.56,43.56 | IC1.88 25.56,43.5 | IC1.67 32.13,38.99 | IC1.57 32.08,33.99 | IC1.43 28.06,30.44 | 25.56,30.48 IC1.38 25.56,27.78 25.88,27.46 | IC1.29 21.06,30.43 | IC1.6 19.04,40.49 | IC1.18 19.01,34.49 | IC1.97 21.06,43.55 | LCD_TOP.4 8.09,22.71 8.41,22.38 | 32.07,43.5 32.07,43.51 | 19.05,43.5 19.05,43.51 | 32.07,30.48 32.07,30.46 | VCCIO.3 23.82,13.01 19.84,16.99 19.84,18.41 18.57,19.68 17.14,19.68
  Top 0.305: 32.07,43.5 30.48,43.5 28.57,43.5 27.62,43.5 25.56,43.5 22.07,43.5 21.11,43.5 20,43.5 19.05,43.5 19.05,40.48 19.05,40.01 19.05,34.45 19.05,32.23 20.8,30.48 21.11,30.48 25.56,30.48 28.1,30.48 32.07,30.48 | 32.07,43.5 32.07,39.05 32.07,33.97 32.07,30.48 | C2.2 33.34,29.21 32.07,30.48 | C4.2 33.34,44.77 32.07,43.5 | C1.2 17.8,44.77 19.05,43.51
  Top 0.406: 8.41,22.38 8.73,22.07 16.99,22.07 | 16.99,22.07 18.73,23.81 22.7,23.81 24.61,25.72 C5.2 | 25.88,26.99 25.88,25.73 | 16.99,22.07 16.99,19.84 16.99,18.28 C6.1 16.96,17.02 L4.1
  Bottom 0.203: v19.05,46.67 v17.14,46.67 15.24,48.58 v15.24,50.8
+5V  (via drill 0.3)
  Top 0.203: LED-.3 6.84,16.82 6.83,16.83 | 26.04,10.49 VCCIO.1 | R4.1 36.81,35.7 v36.04,34.92 | 38.73,35.54 R3.1 | C13.2 28.92,21.57 27.94,22.54 27.94,22.84 R12.2
  Top 0.254: 6.99,13.65 6.83,13.49 IC3.6 | IC4.34 38.85,16.55 39.21,16.19 v39.37,16.19 C15.2 | L2.1 38.42,22.7 37.78,23.34 37.15,23.34 36.92,23.11 IC4.2 36.92,21.84 36.67,21.59 34.77,21.59 34.42,21.93 IC4.7 34.42,23.04 33.5,23.97 C14.2 | 33.5,24.61 C14.2 | IC4.14 30.41,20.55 v30,20.95 29.53,21.43 C13.2 | v32.54,24.61 32.7,24.77 33.5,24.77 C14.2 | 38.73,34.92 IC2.4 38.78,33.95 R2.2 | 38.73,34.92 38.73,35.54 | v39.53,34.92 38.73,34.92 | 22.23,16.67 26.04,12.86 26.04,10.49
  Top 0.406: 20.8,1.27 v17.62,1.27 17.62,2.54 | 20.8,1.27 24.13,1.27 24.61,0.79 41.91,0.79 42.54,1.42 | HPWR.2 41.12,30.16 40.64,30.64 v40.64,31.75 R2.2 | LED+.3 3.49,16.67 3.49,16.99 4.76,16.99 RE2.2 4.79,16.99 5.71,16.99 | 6.83,16.83 6.83,16.99 5.71,16.99 | 5.71,16.99 v5.71,16.51 | ISP.VCC 22.23,16.67 | IC5.3 16.92,2.63 C20.2 17.62,2.54 | 17.62,2.54 C19.2 | 5V.1 20.8,1.27
  Top 0.61: RPI.2 42.55,2.23 | 42.55,2.23 RPI.4 | 42.55,2.23 42.54,2.22 42.54,1.42
  Bottom 0.254: 22.23,17.94 22.86,18.57 27.62,18.57 v30,20.95
  Bottom 0.406: 40.64,22.23 37.94,22.23 35.56,19.84 31.11,19.84 v30,20.95 32.54,23.5 v32.54,24.61 | 40.64,22.23 40.64,16.19 | v39.37,16.19 40.64,16.19 | 44.61,10.48 43.81,10.48 40.64,13.65 40.64,16.19 | v36.04,34.92 v39.53,34.92 | v17.62,1.27 24.13,1.27 24.61,0.79 41.91,0.79 42.55,1.43 | RPI.4 41.12,2.22 | 40.64,22.23 v40.64,31.75 | ISP.VCC 22.23,17.94
  Bottom 0.61: 41.12,2.22 42.55,2.22 | 42.55,2.22 43.66,2.22 | 42.55,1.43 42.55,2.22 | 5.56,16.35 v5.71,16.51
  Bottom 0.813: 45.4,9.68 45.4,3.17 44.46,2.23 RPI.2 | 5.56,16.35 v5.56,11.43 v5.56,10.48 5.56,7.62 11.91,1.27 v17.62,1.27
  other vias: 46.35,10.48 45.09,10.48
  pour Top: 4.29,13.81 4.29,10.64 5.4,9.53 7.46,9.53 7.46,12.38 6.99,12.86 6.99,13.81
  pour Top: 44.45,11.75 44.45,9.05 46.99,9.05 46.99,11.75
  pour Bottom: 44.45,9.05 46.99,9.05 46.99,11.75 44.45,11.75
AREF
  Top 0.203: IC4.42 38.82,20.55 39.37,20 C12.2
AVCC
  Top 0.203: IC4.24 32.92,17.05 37.42,21.55 IC4.44 38.7,21.55 38.89,21.75 40.01,21.75 40.48,21.27 C11.1 40.96,21.3 40.96,21.43 L2.2
B0
  Top 0.203: IC1.10 13.72,38.49 9.68,34.45 9.68,31.75 9.14,31.21 LCD_TOP.21
B1  (via drill 0.3)
  Top 0.203: IC1.11 14.02,37.99 10.32,34.29 v10.32,31.59 | LCD_TOP.22 5.76,31.71 v5.71,31.75
  Bottom 0.203: v5.71,31.75 8.1,31.75 8.41,31.43 10.16,31.43 v10.32,31.59
B2  (via drill 0.3)
  Top 0.203: IC1.12 14.31,37.49 11.11,34.29 v11.11,32.07 | LCD_TOP.23 8.75,32.21 v8.89,32.07
  Bottom 0.203: v8.89,32.07 9.05,32.23 10.95,32.23 v11.11,32.07
B3  (via drill 0.3)
  Top 0.203: IC1.13 14.61,36.99 11.91,34.29 v11.91,32.7 | LCD_TOP.24 v5.72,32.71 v5.71,32.7
  Bottom 0.203: v11.91,32.7 v5.71,32.7
B4  (via drill 0.3)
  Top 0.203: IC1.14 14.9,36.49 12.7,34.29 v12.7,33.34 | LCD_TOP.25 8.76,33.21 v8.89,33.34
  Bottom 0.203: v12.7,33.34 v8.89,33.34
B5  (via drill 0.3)
  Top 0.203: IC1.15 15.19,35.99 13.49,34.29 v13.49,33.97 | LCD_TOP.26 5.77,33.71 v5.71,33.66
  Bottom 0.203: v5.71,33.66 6.03,33.97 v13.49,33.97
B6  (via drill 0.3)
  Top 0.203: IC1.16 15.49,35.49 14.45,34.45 v14.45,34.29 | LCD_TOP.27 8.49,34.21 v8.89,34.61
  Bottom 0.203: v14.45,34.29 14.13,34.61 v8.89,34.61
B7  (via drill 0.3)
  Top 0.203: IC1.17 15.94,34.99 v15.4,34.45 | LCD_TOP.28 5.81,34.71 v5.71,34.61
  Bottom 0.203: v5.71,34.61 7.78,34.61 8.41,35.24 14.61,35.24 v15.4,34.45
CLK  (via drill 0.3)
  Top 0.203: LCD_TOP.30 8.56,35.71 v8.89,36.04 | v29.37,25.72 28.42,25.72 R10.2
  Bottom 0.203: v8.89,36.04 14.92,36.04 16.83,34.13 16.83,29.53 20.64,25.72 v29.37,25.72
CLK_N
  Top 0.152: IC1.94 22.56,45.72 22.55,45.73 22.55,49.37 arc-90 23.97,50.79 49.37,50.79 arc-90 50.79,49.37 50.79,40.32 arc-90 49.53,39.06 43.11,39.06 HDMI.12
CLK_P
  Top 0.152: IC1.93 23.06,45.74 22.85,45.94 22.85,49.37 arc-90 23.97,50.49 49.37,50.49 arc-90 50.49,49.37 50.49,40.32 arc-90 49.53,39.36 44.62,39.36 arc-90 44.29,39.69 arc90 43.98,40 HDMI.10
D0_N
  Top 0.152: IC1.91 24.06,45.8 24.14,45.88 24.14,48.58 arc-90 25.4,49.84 46.35,49.84 arc-90 47.46,48.74 47.46,46.35 arc90 47.94,45.87 49.21,45.87 arc-90 49.84,45.24 arc-90 49.27,44.67 47.92,44.67 arc90 47.66,44.41 47.66,44.21 arc90 47.92,43.94 49.27,43.94 arc-90 49.84,43.37 49.84,43.17 arc-90 49.27,42.6 47.93,42.6 arc90 47.67,42.34 47.67,42.14 arc90 47.93,41.87 49.11,41.87 arc-90 49.68,41.3 49.68,41.12 arc-90 49.05,40.49 43.81,40.49 43.8,40.5 HDMI.9
D0_P
  Top 0.152: IC1.90 24.56,45.76 24.44,45.88 24.44,48.58 arc-90 25.4,49.54 46.35,49.54 arc-90 47.16,48.74 47.16,46.35 arc90 47.94,45.57 49.21,45.57 arc-90 49.54,45.24 arc-90 49.27,44.98 47.93,44.98 arc90 47.36,44.41 47.36,44.21 arc90 47.93,43.64 49.27,43.64 arc-90 49.54,43.37 49.54,43.17 arc-90 49.27,42.91 47.93,42.91 arc90 47.36,42.34 47.36,42.14 arc90 47.93,41.57 49.11,41.57 arc-90 49.38,41.3 49.38,41.12 arc-90 49.05,40.79 44.62,40.79 arc-90 44.29,41.12 arc90 43.91,41.5 HDMI.7
D1_N
  Top 0.152: IC1.86 26.56,45.76 26.68,45.88 26.68,47.78 arc-90 27.78,48.89 29.25,48.89 arc-90 29.82,48.32 arc90 30.08,48.05 30.14,48.05 arc90 30.41,48.32 arc-90 30.98,48.89 31.04,48.89 arc-90 31.61,48.32 arc90 31.88,48.05 31.93,48.05 arc90 32.2,48.32 arc-90 32.77,48.89 32.83,48.89 arc-90 33.4,48.32 arc90 33.67,48.05 33.72,48.05 arc90 33.99,48.32 arc-90 34.56,48.89 34.62,48.89 arc-90 35.19,48.32 arc90 35.46,48.05 35.52,48.05 arc90 35.78,48.32 arc-90 36.35,48.89 36.93,48.89 arc-90 37.5,48.32 37.5,46.77 arc90 37.77,46.5 37.88,46.5 arc90 38.15,46.77 38.15,48.32 arc-90 38.72,48.89 38.84,48.89 arc-90 39.41,48.32 39.41,46.77 arc90 39.68,46.51 39.8,46.51 arc90 40.06,46.77 40.06,48.32 arc-90 40.63,48.89 40.75,48.89 arc-90 41.32,48.32 41.32,46.77 arc90 41.59,46.5 41.71,46.5 arc90 41.97,46.77 41.97,48.32 arc-90 42.55,48.89 45.72,48.89 arc-90 46.51,48.1 46.51,48.01 arc-90 45.94,47.44 arc90 45.67,47.17 45.67,47.12 arc90 45.94,46.85 arc-90 46.51,46.28 46.51,46.23 arc-90 45.94,45.65 arc90 45.67,45.39 45.67,45.33 arc90 45.94,45.06 arc-90 46.51,44.49 46.51,44.44 arc-90 45.94,43.87 arc90 45.67,43.6 45.67,43.54 arc90 45.94,43.27 arc-90 46.51,42.7 46.51,42.55 arc-90 45.88,41.92 43.13,41.92 HDMI.6
D1_P
  Top 0.152: IC1.85 27.06,45.8 26.98,45.88 26.98,47.78 arc-90 27.78,48.58 29.25,48.58 arc-90 29.51,48.32 arc90 30.08,47.75 30.14,47.75 arc90 30.71,48.32 arc-90 30.98,48.58 31.04,48.58 arc-90 31.3,48.32 arc90 31.88,47.75 31.93,47.75 arc90 32.5,48.32 arc-90 32.77,48.58 32.83,48.58 arc-90 33.09,48.32 arc90 33.67,47.75 33.72,47.75 arc90 34.3,48.32 arc-90 34.56,48.58 34.62,48.58 arc-90 34.89,48.32 arc90 35.46,47.75 35.52,47.75 arc90 36.09,48.32 arc-90 36.35,48.58 36.93,48.58 arc-90 37.2,48.32 37.2,46.77 arc90 37.77,46.2 37.88,46.2 arc90 38.46,46.77 38.46,48.32 arc-90 38.72,48.58 38.84,48.58 arc-90 39.11,48.32 39.11,46.77 arc90 39.68,46.2 39.8,46.2 arc90 40.37,46.77 40.37,48.32 arc-90 40.63,48.58 40.75,48.58 arc-90 41.02,48.32 41.02,46.77 arc90 41.59,46.2 41.71,46.2 arc90 42.28,46.77 42.28,48.32 arc-90 42.55,48.58 45.72,48.58 arc-90 46.2,48.1 46.2,48.01 arc-90 45.94,47.75 arc90 45.36,47.17 45.36,47.12 arc90 45.94,46.55 arc-90 46.2,46.28 46.2,46.23 arc-90 45.94,45.96 arc90 45.36,45.39 45.36,45.33 arc90 45.94,44.76 arc-90 46.2,44.49 46.2,44.44 arc-90 45.94,44.17 arc90 45.36,43.6 45.36,43.54 arc90 45.94,42.97 arc-90 46.2,42.7 46.2,42.55 arc-90 45.88,42.22 44.62,42.22 arc-90 44.29,42.55 44.29,42.7 arc90 43.99,43 HDMI.4
D2_N
  Top 0.152: 29.06,45.89 29.06,45.88 | 29.06,45.88 29.06,46.51 arc-90 29.69,47.14 35.72,47.14 arc-90 36.74,46.12 36.74,40.26 arc90 37.01,39.99 37.06,39.99 arc90 37.32,40.26 37.32,44.83 arc-90 37.9,45.4 37.94,45.4 arc-90 38.51,44.83 38.51,40.35 arc90 38.78,40.08 38.83,40.08 arc90 39.09,40.35 39.09,44.83 arc-90 39.66,45.4 39.71,45.4 arc-90 40.28,44.83 40.28,40.26 arc90 40.55,39.99 40.6,39.99 arc90 40.86,40.26 40.86,44.83 arc-90 41.43,45.4 44.29,45.4 arc-90 44.92,44.77 44.92,44.61 arc-90 44.93,44.6 44.93,44.38 arc-90 44.04,43.5 HDMI.3 | IC1.81 29.06,45.88
D2_P
  Top 0.152: IC1.80 29.56,45.75 29.36,45.94 29.36,46.51 arc-90 29.69,46.84 35.72,46.84 arc-90 36.44,46.12 36.44,40.26 arc90 37.01,39.69 37.06,39.69 arc90 37.63,40.26 37.63,44.83 arc-90 37.9,45.09 37.94,45.09 arc-90 38.21,44.83 38.21,40.26 arc90 38.78,39.69 38.83,39.69 arc90 39.4,40.26 39.4,44.83 arc-90 39.66,45.09 39.71,45.09 arc-90 39.98,44.83 39.98,40.26 arc90 40.55,39.69 40.6,39.69 arc90 41.17,40.26 41.17,44.83 arc-90 41.43,45.09 44.29,45.09 arc-90 44.62,44.77 44.62,44.39 arc-90 44.45,44.22 arc-90 44.29,44.38 arc90 44.17,44.5 HDMI.1
D_N
  Top 0.152: R14.2 39.53,24.29 39.05,24.77 38.09,24.77 arc90 36.35,23.02 36.42,22.94 IC4.3
D_P
  Top 0.152: R13.2 39.53,25.56 39.05,25.08 38.11,25.08 arc90 36.04,23.02 35.92,22.9 IC4.4
DDC_SCL
  Top 0.203: SCL.1 36.35,30.16 36.83,30.64 IC2.1 36.83,32.23 35.24,33.81 35.24,35.72 36.83,37.31 | 36.83,37.31 R4.2 | HDMI.15 41.56,37.5 41.43,37.62 37.15,37.62 36.83,37.31
DDC_SDA
  Top 0.152: IC2.3
  Top 0.203: IC2.3 38.73,32.23 37.94,33.02 37.94,36.35 38.34,36.75 38.73,36.75 R3.2 39.04,37 HDMI.16 | SDA.1 IC2.3
DE  (via drill 0.3)
  Top 0.203: LCD_TOP.34 5.95,37.71 v5.71,37.94 | IC1.46 29.56,27.81 v29.37,27.62
  Bottom 0.203: v5.71,37.94 15.56,37.94 18.41,35.08 18.41,30.48 21.27,27.62 v29.37,27.62
G0
  Top 0.203: LCD_TOP.13 8.35,27.21 8.57,26.99 9.21,26.99 9.68,27.46 9.68,29.05 14.13,33.5 IC1.20
G1  (via drill 0.3)
  Top 0.203: IC1.21 14.41,32.99 10.48,29.05 v10.48,27.15 | LCD_TOP.14 5.79,27.71 v5.71,27.78
  Bottom 0.203: v5.71,27.78 7.62,27.78 8.26,27.15 v10.48,27.15
G2  (via drill 0.3)
  Top 0.203: IC1.22 14.71,32.49 11.27,29.05 v11.27,27.78 | LCD_TOP.15 8.46,28.21 v8.89,27.78
  Bottom 0.203: v8.89,27.78 v11.27,27.78
G3  (via drill 0.3)
  Top 0.203: IC1.23 15,31.99 12.06,29.05 v12.06,28.42 | LCD_TOP.16 5.74,28.71 v5.71,28.73
  Bottom 0.203: v5.71,28.73 6.03,28.42 v12.06,28.42
G4  (via drill 0.3)
  Top 0.203: IC1.24 15.3,31.49 13.02,29.21 v13.02,28.89 | LCD_TOP.17 8.73,29.21 v8.89,29.05
  Bottom 0.203: v8.89,29.05 12.86,29.05 v13.02,28.89
G5  (via drill 0.3)
  Top 0.203: IC1.25 15.59,30.99 13.97,29.37 v13.97,29.05 | LCD_TOP.18 5.74,29.71 v5.71,29.69
  Bottom 0.203: v5.71,29.69 13.49,29.69 13.97,29.21 v13.97,29.05
G6  (via drill 0.3)
  Top 0.203: LCD_TOP.19 8.78,30.21 v8.89,30.32 | IC1.26 19.56,28.61 19.53,28.57 v14.76,28.57
  Bottom 0.203: v8.89,30.32 13.81,30.32 14.76,29.37 v14.76,28.57
G7  (via drill 0.3)
  Top 0.203: LCD_TOP.20 5.81,30.71 v5.71,30.8 | v15.56,29.37 18.41,29.37 19.21,30.16 19.68,30.16 20.06,29.79 IC1.27
  Bottom 0.203: v5.71,30.8 5.87,30.96 13.97,30.96 v15.56,29.37
GND  (via drill 0.3)
  Top 0.152: 7.94,22.23 8.41,21.75
  Top 0.254: SW1.4 51.15,12.54
  Top 0.305: 51.15,13.46 51.15,12.54 | SW1.4 SW1.3 51.15,7.49
  Top 0.813: v21.75,36.99 v29.37,36.99 | v25.56,40.8 v25.56,33.18
  Bottom 0.305: 51.15,13.46 51.15,12.54 | SW1.4 51.15,7.49
  other vias: 25.56,36.99 24.29,36.99 26.83,36.99 28.1,36.99 29.37,38.26 28.1,38.26 26.83,38.26 25.56,38.26 24.29,38.26 23.02,38.26 21.75,38.26 23.02,36.99 21.75,39.53 21.75,40.8 23.02,40.8 24.29,40.8 20.48,40.8 20.48,39.53 20.48,38.26 20.48,36.99 30.64,36.99 30.64,38.26 29.37,39.53 30.64,39.53 26.83,39.53 28.1,39.53 25.56,39.53 24.29,39.53 23.02,39.53 21.75,42.07 23.02,42.07 24.29,42.07 25.56,42.07 20.48,42.07 26.83,40.8 28.1,40.8 29.37,40.8 30.64,40.8 26.83,42.07 28.1,42.07 29.37,42.07 30.64,42.07 26.83,33.18 28.1,33.18 29.37,33.18 30.64,33.18 21.75,34.45 21.75,35.72 23.02,35.72 24.29,35.72 25.56,35.72 20.48,35.72 20.48,34.45 29.37,34.45 30.64,34.45 26.83,34.45 28.1,34.45 25.56,34.45 24.29,34.45 23.02,34.45 26.83,35.72 28.1,35.72 29.37,35.72 30.64,35.72 21.75,31.91 21.75,33.18 23.02,33.18 24.29,33.18 20.48,33.18 20.48,31.91 29.37,31.91 30.64,31.91 26.83,31.91 28.1,31.91 25.56,31.91 24.29,31.91 23.02,31.91 19.21,30.96 16.03,30.32 2.38,11.59 5.71,22.54 44.93,36.35 28.1,46.67 25.56,46.67 23.5,46.67 35.4,46.04 33.34,46.04 44.93,38.26 41.43,39.21 21.59,48.74 21.59,50.8 46.83,38.26 48.74,38.26 50.8,38.42 39.69,39.21 37.94,39.21 35.88,39.37 35.56,41.27 35.56,43.34 50.8,50.8 44.16,24.9 45.09,26.04 32.86,20.95 39.69,17.3 37.47,23.97 36.04,24.77 37.47,25.72 43.5,23.65 43.5,26.19 39.69,20.95 50.8,6.35 45.9,18.1 26.83,21.43 1.27,46.35 1.27,41.27 1.27,24.13 15.88,20.95 35.56,31.75 26.04,16.99 50.82,29.21 1.27,5.71 1.27,31.43 49.69,49.53 48.1,49.53 23.5,48.74 25.56,48.74 21.59,46.67 5.71,35.72 46.83,41.43 49.69,40.01 46.83,39.93 46.83,45.4 46.83,43.5 39.69,15.4 32.38,28.26 43.97,22.38 2.38,13.34 2.38,15.08 10.79,11.43 16.51,43.81 15.24,46.83 10.79,10.16 13.34,40.16 6.35,46.51 17.62,43.81 41.43,36.35 1.27,19.05 9.05,21.27 18.41,20.95 7.62,7.78 10.79,4.6 18.41,4.45 32.7,14.61 43.97,8.41 47.47,8.41 18.41,16.51 32.38,26.04 39.37,26.51 39.37,23.34 41.59,26.04 41.59,23.81 50.8,18.26 37.78,30.32 24.13,6.35 43.2,18.1 17.14,23.65 12.38,22.86 8.26,1.27 13.34,18.41 27.78,11.91
  pour Bottom (rank 2): 0,0 52,0 52,52 0,52
  pour Top (rank 2): 0,0 52,0 52,52 0,52
GPIO
  Top 0.203: IC4.25 33.42,14.36 34.29,13.49 36.04,13.49 37.62,11.91 38.58,11.91 38.62,11.86 T8.6
HDMI_5V
  Top 0.254: 43.18,28.29 C23.2 | 41.17,28.29 HPWR.1 | 42.23,28.45 42.23,28.29
  Top 0.305: 42.23,28.45 42.23,33.97 42.86,34.61 44.13,34.61 44.61,35.08 44.61,35.56 44.17,36 HDMI.18 | 43.18,28.29 42.23,28.29 41.17,28.29
HDMI_DECT
  Top 0.203: HDMI.19 41.19,35.5 R2.1
HSYNC  (via drill 0.3)
  Top 0.203: LCD_TOP.32 5.75,36.71 v5.71,36.67 | IC1.48 30.56,28.02 v30.96,27.62
  Bottom 0.203: v5.71,36.67 15.24,36.67 17.46,34.45 17.46,29.84 20.95,26.35 30.48,26.35 30.96,26.83 v30.96,27.62
HWB
  Top 0.203: IC4.33 37.42,15.44 38.1,14.76 40.77,14.76 R15.1
LED1  (via drill 0.3)
  Top 0.203: IC4.31 36.42,15.01 37.94,13.49 41.75,13.49 42.23,13.02 v43.18,13.02 | R18.1 v45.88,14.92
  Bottom 0.203: v43.18,13.02 45.09,14.92 v45.88,14.92
LED2  (via drill 0.3)
  Top 0.203: IC4.32 36.92,15.14 38.1,13.97 42.39,13.97 v42.55,13.81 | R19.1 v45.88,16.51
  Bottom 0.203: v42.55,13.81 45.24,16.51 v45.88,16.51
LED+
  Top 0.203: LED+.1
  Top 0.254: IC3.5 5.24,14.45 4.92,14.13 1.27,14.13 | C9.2
  Top 0.406: 5.05,7.46 D6.C
  Top 0.61: LED+.1 1.27,14.13 1.27,8.57 2.38,7.46 C9.2 | C9.2 5.05,7.46
LED-
  Top 0.406: 8.41,15.47 IC3.3 8.73,15.4 9.04,15.71 LED-.1 9.04,16.82 9.07,16.85 RS1.2 RS2.2 RS3.2 RS4.2 RS5.2
LEDA
  Top 0.254: LCD_TOP.2 6.15,21.71 6.03,21.59
  Top 0.406: 6.03,21.59 3.02,21.59 2.38,20.95 LED+.2
LEDC
  Top 0.254: LCD_TOP.1 7.3,20.96 7.3,20.95
  Top 0.406: 7.3,20.95 7.3,17.78 7.94,17.14 LED-.2
LIGHT  (via drill 0.3)
  Top 0.203: IC4.40 38.87,19.55 39.69,18.73 | 39.69,18.73 C16.2 R16.2 | v39.53,18.73 39.69,18.73
  Bottom 0.203: v39.53,18.73 38.1,17.3 38.1,15.72 35.72,13.34 34.77,13.34 34.13,12.7 34.13,8.89 30.92,5.68 30.92,5.52
  Bottom 0.406: 30.92,5.52 30.92,4.79 RPI.11
LV_GPIO  (via drill 0.3)
  Top 0.203: 35.4,5.4 34.61,6.19 28.57,6.19 26.67,8.1 20.48,8.1 19.21,9.37 TP_INT.2 | R24.1 38.1,9.82 | 38.1,9.82 38.54,9.82 T8.1 | v38.1,8.89 38.1,9.82
  Top 0.406: RPI.7 35.4,5.4
  Bottom 0.203: 36.04,5.56 38.1,7.62 v38.1,8.89
  Bottom 0.406: 36.04,5.56 36.04,4.79 RPI.7
LV_PWM2  (via drill 0.3)
  Top 0.203: LCD_TOP.35 6.4,38.21 5.87,38.73 4.92,38.73 3.81,37.62 3.81,24.13 v1.27,21.59 | R25.1 40.2,11.77 T8.4 40.12,12.11 39.69,12.54 37.62,12.54 36.2,13.97 34.77,13.97 34.29,14.45 v34.29,14.61
  Bottom 0.203: v1.27,21.59 2.22,21.59 10.79,13.02 26.51,13.02 30,16.51 32.7,16.51 34.29,14.92 v34.29,14.61
LV_RXD  (via drill 0.3)
  Top 0.203: R22.1 33.46,9.82 T7.1 33.54,9.48 34.29,8.73 36.83,8.73 v36.99,8.89
  Bottom 0.203: 35.4,2.86 34.77,3.49 34.77,5.71 36.99,7.94 v36.99,8.89
  Bottom 0.406: RPI.8 35.4,2.86
LV_SCL
  Top 0.203: 37.92,5.41 36.51,6.83 28.89,6.83 27.94,7.78 27.94,8.73 | 27.94,8.73 22.7,8.73 22.07,9.37 TP_SCL.2 | T6.1 28.86,9.82 R20.1 27.94,8.73
  Top 0.406: 37.92,5.41 RPI.5
LV_SDA  (via drill 0.3)
  Top 0.203: v29.21,7.62 29.37,7.46 38.42,7.46 40.47,5.41 | R21.1 30.64,11.77 | 30.64,11.77 30.51,11.77 | 30.51,11.77 T6.4 | TP_SDA.2 v20.64,8.89 | 30.51,11.77 30.5,11.77 30.48,11.75 | v30.64,12.54 30.64,11.77
  Top 0.406: 40.47,5.41 RPI.3
  Bottom 0.203: v30.64,12.54 30.64,9.05 v29.21,7.62 29.05,7.46 22.07,7.46 v20.64,8.89
LV_TXD  (via drill 0.3)
  Top 0.203: T7.4 35.12,11.77 R23.1 36.81,11.77 v36.83,11.75
  Bottom 0.203: v36.83,11.75 36.83,9.68 36.04,8.89 35.4,8.89 32.23,5.71 32.23,3.49 32.86,2.86
  Bottom 0.406: RPI.10 32.86,2.86
LX
  Top 0.203: 9.05,11.04 L1.2 | 9.84,7.81 D6.A
  Top 0.406: IC3.1 8.34,12.93 | 9.05,12.22 9.05,11.04
  Top 0.61: 8.34,12.93 9.05,12.22 | L1.2 9.14,9.6 9.84,8.89 9.84,7.81
MISO
  Top 0.152: IC4.11 32,22.45 30.48,23.97 26.83,23.97 26.19,23.34 26.19,18.57 24.92,17.3
  Top 0.406: 24.92,17.3 ISP.MISO
MOSI
  Top 0.152: 22.23,19.21 22.86,18.57 25.08,18.57 25.88,19.37 25.88,23.5 26.67,24.29 30.64,24.29 31.75,23.18 32.7,23.18 32.92,22.95 IC4.10
  Top 0.406: ISP.MOSI 22.23,19.21
N$1
  Top 0.406: RS3.1 12.54,15.4 11.91,14.76 J20_2.1
N$3
  Top 0.203: IC1.44 28.56,27 R10.1
N$4
  Top 0.406: RS4.1 13.65,15.24 13.34,14.92 J30_1.1
N$5
  Top 0.406: RS2.1 11.43,15.56 10.48,14.61 J20_1.1
N$6
  Top 0.203: R26.2 42.39,8.1 43.5,6.99 47.31,6.99 48.42,8.1 48.42,10 48.9,10.48 49.65,10.48
  Top 0.406: SW1.2 49.65,10.48 SW1.1
N$7
  Top 0.406: RS5.1 J30_2.1
N$17
  Top 0.203: R18.2 LED1.A
N$18
  Top 0.203: R19.2 LED2.A
OCKINV
  Top 0.203: IC1.100 19.56,45.91 20.32,46.67 20.32,47.94 20.02,48.24 OCK.1 R5.2
PDO
  Top 0.203: LCD_TOP.31 8.11,36.21 8.57,36.67 11.11,36.67 13.63,39.19 R9.1 15.74,39.19 15.94,38.99 IC1.9
PIXS
  Top 0.203: IC1.4 16.3,41.49 15.08,42.7 15.08,45.56 16.51,46.99 16.51,47.94 16.81,48.24 PIXS.1 R6.2
PWM1  (via drill 0.3)
  Top 0.203: IC3.4 5.39,15.4 | 5.39,15.4 5.08,15.08 RE1.2 | IC3.4 5.4,15.4 | RE2.1 4.95,16.01 5.4,15.56 5.4,15.4 | 5.4,15.4 5.39,15.4 | IC4.29 35.42,14.79 v35.24,14.61 | IC3.4 v6.98,15.4 v6.99,15.4
  Bottom 0.203: v6.99,15.4 7.62,15.4 10.64,12.38 26.67,12.38 30.32,16.03 32.38,16.03 33.34,15.08 33.34,13.81 | 30.32,2.86 29.69,3.49 29.69,5.56 33.34,9.21 33.34,13.81 | v35.24,14.61 35.24,14.45 34.61,13.81 33.34,13.81
  Bottom 0.406: RPI.12 30.32,2.86
PWM2
  Top 0.203: IC4.30 35.92,14.88 37.78,13.02 41.27,13.02 42.07,12.22 42.07,10.32 41.43,9.68 40.33,9.68 T8.3
R0
  Top 0.203: IC1.30 21.56,28.07 21.27,27.78 13.02,27.78 9.84,24.61 9.84,23.34 9.37,22.86 8.73,22.86 8.38,23.21 LCD_TOP.5
R1  (via drill 0.3)
  Top 0.203: IC1.31 22.06,27.93 21.43,27.3 13.34,27.3 10.48,24.45 v10.48,22.86 | LCD_TOP.6 5.77,23.71 v5.71,23.65
  Bottom 0.203: v5.71,23.65 6.51,22.86 v10.48,22.86
R2  (via drill 0.3)
  Top 0.203: IC1.32 22.56,27.8 21.59,26.83 13.65,26.83 11.43,24.61 v11.43,23.5 | LCD_TOP.7 8.34,24.21 v9.05,23.5
  Bottom 0.203: v9.05,23.5 v11.43,23.5
R3  (via drill 0.3)
  Top 0.203: IC1.33 23.06,27.66 21.75,26.35 13.97,26.35 12.38,24.77 v12.38,24.13 | LCD_TOP.8 5.77,24.71 v5.71,24.77
  Bottom 0.203: v5.71,24.77 6.35,24.13 v12.38,24.13
R4  (via drill 0.3)
  Top 0.203: IC1.34 23.56,27.53 21.91,25.88 14.45,25.88 v13.34,24.77 | LCD_TOP.9 8.45,25.21 v8.89,24.77
  Bottom 0.203: v8.89,24.77 v13.34,24.77
R5  (via drill 0.3)
  Top 0.203: IC1.35 24.06,27.39 22.07,25.4 15.08,25.4 v14.45,24.77 | LCD_TOP.10 5.73,25.71 v5.71,25.72
  Bottom 0.203: v5.71,25.72 6.03,25.4 13.81,25.4 v14.45,24.77
R6  (via drill 0.3)
  Top 0.203: IC1.36 24.56,27.26 22.23,24.92 15.72,24.92 v15.56,24.77 | LCD_TOP.11 8.72,26.21 v8.89,26.04
  Bottom 0.203: v8.89,26.04 14.29,26.04 v15.56,24.77
R7  (via drill 0.3)
  Top 0.203: LCD_TOP.12 5.84,26.71 v5.71,26.83 | IC1.37 25.06,27.12 22.38,24.45 16.51,24.45 v16.35,24.29
  Bottom 0.203: v5.71,26.83 5.87,26.67 9.68,26.67 9.84,26.51 14.92,26.51 16.35,25.08 v16.35,24.29
RST  (via drill 0.3)
  Top 0.203: IC4.13 31.02,21.05 30,22.07 v30,22.54 29.69,22.86 R12.1
  Bottom 0.203: v30,22.54 29.84,22.38 24.92,22.38
  Bottom 0.406: ISP.RST 24.92,22.38
RXD
  Top 0.203: IC4.20 30.89,17.55 30.16,16.83 30.16,14.13 31.59,12.7 32.7,12.7 33.54,11.86 T7.6
SCDT
  Top 0.203: IC1.8 16.39,39.49 15.69,40.19 R9.2
SCK
  Top 0.152: 24.92,19.84 25.56,20.48 25.56,23.65 26.51,24.61 30.8,24.61 31.75,23.65 32.86,23.65 33.42,23.09 IC4.9
  Top 0.406: ISP.SCK 24.92,19.84
SCL  (via drill 0.3)
  Top 0.203: v33.97,20.95 33.97,19.68 32.84,18.55 IC4.18 30.61,18.55 29.21,17.14 29.21,13.81 28.94,13.54 T6.6 | SCL.2 36.35,27.94 36.2,27.78 35.08,27.78 v34.61,27.3
  Bottom 0.203: v33.97,20.95 33.97,26.67 v34.61,27.3
SDA  (via drill 0.3)
  Top 0.203: v29.69,13.18 29.69,16.99 30.75,18.05 IC4.19 33.13,18.05 35.08,20 v35.08,20.95 | SDA.2 38.73,27.78 37.78,26.83 v36.51,26.83 | T6.3 30.44,9.48 29.84,8.89 v29.21,8.89
  Bottom 0.203: v35.08,20.95 35.08,25.4 v36.51,26.83 | v29.21,8.89 29.69,9.37 v29.69,13.18
SHLD1
  Top 0.203: USB.SHLD2 49.22,23.96 49.21,23.97 | USB.SHLD1 49.24,22.04 49.21,22.07
  Top 0.406: 49.21,26.19 49.21,23.97 49.21,22.07 49.21,19.05 48.26,18.1 R17.2
SHLD3
  Top 0.406: R1.2 47.59,31.9 HDMI.SHLD2
  Bottom 0.406: 47.78,32.54 44,32.54 HDMI.SHLD1 | 47.78,32.54 48.9,32.54 HDMI.SHLD2 | 47.78,32.54 47.78,46.99 | 47.78,46.99 48.9,46.99 HDMI.SHLD3 | 47.78,46.99 HDMI.SHLD4
ST
  Top 0.203: IC1.3 16.59,41.99 15.72,42.86 15.72,45.4 16.19,45.88 17.46,45.88 17.78,46.2 17.78,47.94 18.08,48.24 ST.1 R7.2
STAG
  Top 0.203: IC1.7 16.68,39.99 14.29,42.39 14.29,46.99 15.54,48.24 STAG.2 R8.1
SW1  (via drill 0.3)
  Top 0.203: IC4.22 31.31,16.55 31.27,16.51 31.27,15.08 v31.75,14.61 | R26.1 32.38,8.1 v31.59,8.89
  Bottom 0.203: v31.75,14.61 31.75,9.05 v31.59,8.89 31.59,8.73 28.42,5.56 | 28.42,4.79 RPI.13
  Bottom 0.406: 28.42,5.56 28.42,4.79
TXD  (via drill 0.3)
  Top 0.203: IC4.21 31.02,17.05 30.64,16.67 30.64,14.45 31.75,13.34 33.66,13.34 34.29,12.7 v35.24,12.7 | T7.3 35.24,9.68 v35.88,9.68
  Bottom 0.203: v35.24,12.7 35.24,10.32 v35.88,9.68
UCAP
  Top 0.203: IC4.6 C10.2
USBD_N
  Top 0.152: R14.1 40.8,24.29 41.28,24.77 42.07,24.77 D1.2 | D1.2 42.54,24.3 44.13,24.3 arc-90 44.45,23.98 44.45,23.18 arc90 45.28,22.35 USB.D- | D1.2
USBD_P
  Top 0.152: R13.1 40.8,25.56 41.28,25.08 42.07,25.08 D1.1 | D1.1 42.55,25.55 43.97,25.55 arc-90 44.92,24.61 44.92,23.81 arc90 45.73,23 USB.D+ | D1.1
VBUS
  Top 0.406: L3.2 | USB.VBUS 45.2,21.7 45.09,21.59
  Top 0.61: 45.09,21.59 44.45,20.95
  Top 0.813: L3.2 44.45,14.45 44.45,20.95
VCCIO  (via drill 0.3)
  Top 0.203: T6.2 29.69,10.79 T6.5 | T7.2 34.29,10.79 T7.5 | 41.09,10.79 R25.2 | R24.2 37.62,10.79 | R23.2 36.04,10.79 | T8.5 39.37,10.79 T8.2 v39.37,8.89 | R21.2 31.43,10.79 | R22.2 32.54,10.79 | R20.2 27.94,10.79
  Top 0.254: 41.09,10.79 39.37,10.79 37.62,10.79 36.04,10.79 34.29,10.79 32.54,10.79 31.43,10.79 29.69,10.79 27.94,10.79 27.46,10.79 26.99,10.32 26.99,9.84 26.51,9.37 25.4,9.37 24.92,9.84 VCCIO.2
  Bottom 0.203: 43.02,5.4 39.53,8.89 v39.37,8.89
  Bottom 0.406: RPI.1 43.02,5.4
VSYNC  (via drill 0.3)
  Top 0.203: LCD_TOP.33 8.79,37.21 v8.89,37.31 | IC1.47 30.06,27.25 v30.16,27.15
  Bottom 0.203: v8.89,37.31 15.4,37.31 17.94,34.77 17.94,30.16 21.11,26.99 30,26.99 v30.16,27.15
X+  (via drill 0.3)
  Top 0.203: IC4.39 37.62,19.05 37.15,19.53 v36.99,19.53 | LCD_TOP.37 8.26,39.21 8.57,38.89 v8.89,38.89 | v19.84,15.56 19.68,15.4 19.68,14.29 20.64,13.34 TP_SDA.1 | TP_BOT.4 12.93,48.81 v13.49,49.37
  Bottom 0.203: v36.99,19.53 36.51,19.53 35.56,18.57 28.89,18.57 25.88,15.56 v19.84,15.56 11.43,15.56 4.13,22.86 4.13,37.94 5.08,38.89 v8.89,38.89 10,38.89 13.49,42.39 v13.49,49.37
X-  (via drill 0.3)
  Top 0.203: LCD_TOP.39 8.85,40.21 v8.89,40.16 11.75,40.16 13.65,42.07 13.65,46.83 | IC4.37 37.1,18.05 v36.99,17.94 | R11.1 14.61,48.26 13.65,47.31 13.65,46.83 | TP_BOT.2 13.63,46.81 13.65,46.83
  Bottom 0.203: v8.89,40.16 8.41,40.64 4.92,40.64 2.86,38.58 2.86,22.54 11.11,14.29 26.19,14.29 29.53,17.62 36.2,17.62 36.51,17.94 v36.99,17.94
XTAL1
  Top 0.203: IC4.17 30.16,19.05 28.8,17.69 Q1.2
XTAL2
  Top 0.203: IC4.16 29.66,19.55 29.12,20.09 Q1.1
Y+  (via drill 0.3)
  Top 0.203: v3.49,40.16 4.04,40.71 LCD_TOP.40 8.32,40.71 8.41,40.8 11.59,40.8 12.86,42.07 12.86,45.72 12.77,45.81 TP_BOT.1 | IC4.36 37.55,17.55 37.15,17.14 v36.67,17.14 | TP_INT.1 v19.21,13.65
  Bottom 0.203: v3.49,40.16 2.22,38.89 2.22,22.38 10.95,13.65 v19.21,13.65 26.35,13.65 29.84,17.14 v36.67,17.14
Y-  (via drill 0.3)
  Top 0.203: IC4.38 37.17,18.55 36.99,18.73 v36.67,18.73 | LCD_TOP.38 5.86,39.71 v5.71,39.85 | v20.48,14.92 20.48,14.29 22.07,12.7 TP_SCL.1 | TP_BOT.3 10.5,47.81 v10.48,47.78
  Bottom 0.203: v36.67,18.73 36.51,18.73 35.88,18.1 29.21,18.1 26.04,14.92 v20.48,14.92 11.27,14.92 3.49,22.7 3.49,38.26 5.08,39.85 v5.71,39.85 6.03,39.53 9.53,39.53 10.48,40.48 v10.48,47.78

### Text on the board
Top: TOP
Bottom: watterott.com | BOT
tPlace: HDMI-Display Rev 1.1 | github.com/watterott/HDMI-Display | o | 40 | 40 | watterott.com | EDID | (LED) | (LED) | GND | RST | o | 1 | 1 | 2 | 5V | 5V | 5V | 1 | 20 20 30 30 | LED Boost Converter | 3V3 | 5V | 1 | 16
Reference: Silkscreen: 21 tPlace